# Altium project S7CAS-PLEIADES-CARTE-MERE-P_07.PrjPcb (part 1 of 2)
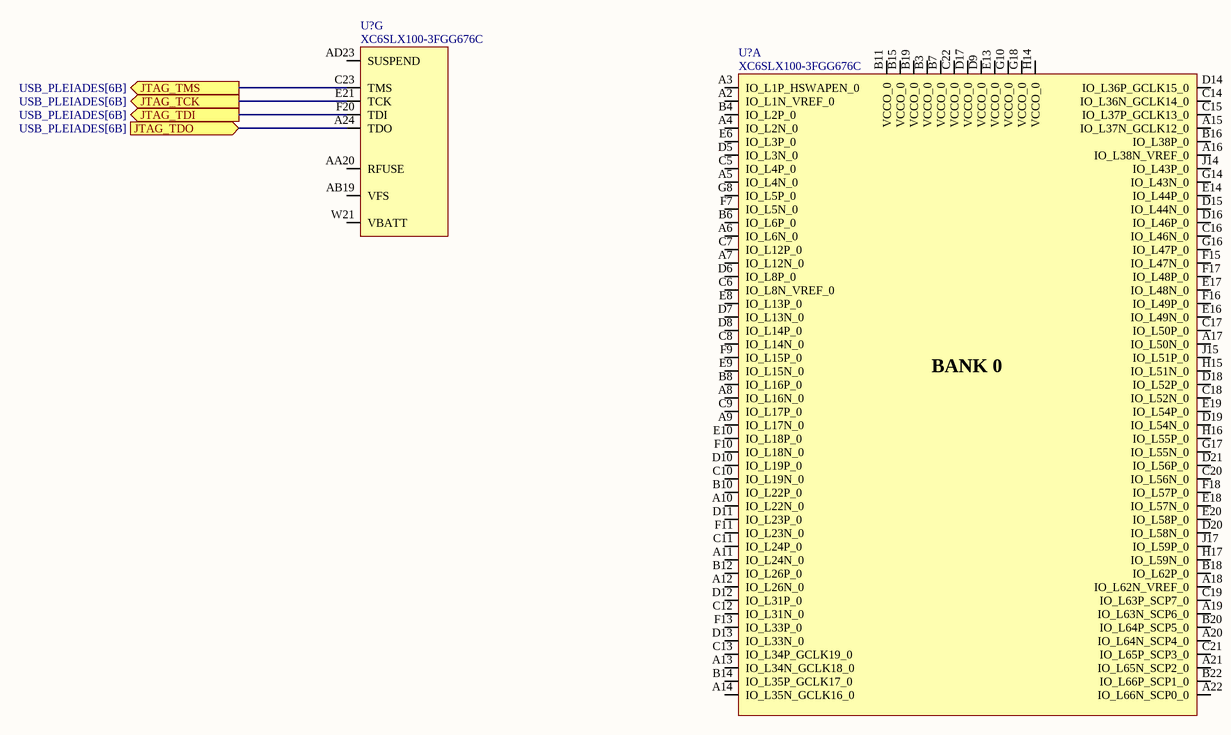
[diagram p0: FPGA_PLEIADES.SchDoc]
9 sheets, 185 parts. Net scope: flat (ports and power ports of the same name join across sheets).
Sheets:
  FPGA_PLEIADES.SchDoc
  FPGA_2_PLEIADES.SchDoc
  USB_PLEIADES.SchDoc
  CLOCK_PLEIADES.SchDoc
  FLASH_PLEIADES.SchDoc
  ETHERNET_PLEIADES.SchDoc
  DDR3_PLEIADES.SchDoc
  ADC_1_PLEIADES.SchDoc
  ADC_2_PLEIADES.SchDoc

## Sheet FPGA_PLEIADES.SchDoc
size Tabloid; SheetNumber: 1; SheetTotal: 8; Sheet_Name: Insert name in Document Parameters; Size: 11x17

### Parts
(Parts that share a designator on the sheet are numbered #1, #2 ... from top to bottom, then left to right.)
U?#1  XC6SLX100-3FGG676C  [FPGA_XILINX_FGG676]  (part G of 10)
U?#2  XC6SLX100-3FGG676C  [FPGA_XILINX_FGG676]  (part A of 10)

### Ports
JTAG_TCK (out, see USB_PLEIADES[6B]), JTAG_TDI (out, see USB_PLEIADES[6B]), JTAG_TDO (in, see USB_PLEIADES[6B]), JTAG_TMS (out, see USB_PLEIADES[6B])

### Nets
NetM??#1_10: U?#1.E21(TCK) ; port JTAG_TCK
NetM??#1_11: U?#1.A24(TDO) ; port JTAG_TDO
NetM??#1_12: U?#1.F20(TDI) ; port JTAG_TDI
NetM??#1_13: U?#1.C23(TMS) ; port JTAG_TMS

Not connected (* = marked no-connect by the designer): U?#1 AA20(RFUSE) AB19(VFS) AD23(SUSPEND) W21(VBATT); U?#2 A2(IO_L1N_VREF_0) A3(IO_L1P_HSWAPEN_0) A4(IO_L2N_0) A5(IO_L4N_0) A6(IO_L6N_0) A7(IO_L12N_0) A8(IO_L16N_0) A9(IO_L17N_0) A10(IO_L22N_0) A11(IO_L24N_0) A12(IO_L26N_0) A13(IO_L34N_GCLK18_0) A14(IO_L35N_GCLK16_0) A15(IO_L37N_GCLK12_0) A16(IO_L38N_VREF_0) A17(IO_L50N_0) A18(IO_L62N_VREF_0) A19(IO_L63N_SCP6_0) A20(IO_L64N_SCP4_0) A21(IO_L65N_SCP2_0) A22(IO_L66N_SCP0_0) B3(VCCO_0) B4(IO_L2P_0) B6(IO_L6P_0) B7(VCCO_0) B8(IO_L16P_0) B10(IO_L22P_0) B11(VCCO_0) B12(IO_L26P_0) B14(IO_L35P_GCLK17_0) B15(VCCO_0) B16(IO_L38P_0) B18(IO_L62P_0) B19(VCCO_0) B20(IO_L64P_SCP5_0) B22(IO_L66P_SCP1_0) C5(IO_L4P_0) C6(IO_L8N_VREF_0) C7(IO_L12P_0) C8(IO_L14N_0) C9(IO_L17P_0) C10(IO_L19N_0) C11(IO_L24P_0) C12(IO_L31N_0) C13(IO_L34P_GCLK19_0) C14(IO_L36N_GCLK14_0) C15(IO_L37P_GCLK13_0) C16(IO_L46N_0) C17(IO_L50P_0) C18(IO_L52N_0) C19(IO_L63P_SCP7_0) C20(IO_L56N_0) C21(IO_L65P_SCP3_0) C22(VCCO_0) D5(IO_L3N_0) D6(IO_L8P_0) D7(IO_L13N_0) D8(IO_L14P_0) D9(VCCO_0) D10(IO_L19P_0) D11(IO_L23P_0) D12(IO_L31P_0) D13(IO_L33N_0) D14(IO_L36P_GCLK15_0) D15(IO_L44N_0) D16(IO_L46P_0) D17(VCCO_0) D18(IO_L52P_0) D19(IO_L54N_0) D20(IO_L58N_0) D21(IO_L56P_0) E6(IO_L3P_0) E8(IO_L13P_0) E9(IO_L15N_0) E10(IO_L18P_0) E13(VCCO_0) E14(IO_L44P_0) E16(IO_L49N_0) E17(IO_L48N_0) E18(IO_L57N_0) E19(IO_L54P_0) E20(IO_L58P_0) F7(IO_L5N_0) F9(IO_L15P_0) F10(IO_L18N_0) F11(IO_L23N_0) F13(IO_L33P_0) F15(IO_L47N_0) F16(IO_L49P_0) F17(IO_L48P_0) F18(IO_L57P_0) G8(IO_L5P_0) G10(VCCO_0) G14(IO_L43N_0) G16(IO_L47P_0) G17(IO_L55N_0) G18(VCCO_0) H14(VCCO_0) H15(IO_L51N_0) H16(IO_L55P_0) H17(IO_L59N_0) J14(IO_L43P_0) J15(IO_L51P_0) J17(IO_L59P_0)

### Notes on the sheet
- Sheet Name
- Project Title
- Global Project
- Size
- Group
- Revision
- Date
- Sheet
- of
- Filename
- Designers
- (in symbol FPGA_XC6SLX100-3FGG676C, part A) BANK 0

### Library data of the parts
U?#1 U?#2 = FPGA_XC6SLX100-3FGG676C: FPGA - XILINX SPARTAN 6 480 I/O - BGA-676; Voltage: 1.14 V ~ 1.26 V; Current: *; Power: *; Mfg: Xilinx; Mfg Part Number: XC6SLX100-3FGG676C; HelpURL: https://www.xilinx.com/support/documentation/data_sheets/ds162.pdf; CreatedBy: Jonathan Bouchard; Temperature: 0°C ~ 85°C (TJ); Value: *; Precision: *; Package: BGA-676; Supplier 1: Digikey; Supplier Part Number 1: 122-1760-ND

## Sheet FPGA_2_PLEIADES.SchDoc
size Tabloid; SheetNumber: 2; SheetTotal: 8; Sheet_Name: Insert name in Document Parameters; Size: 11x17
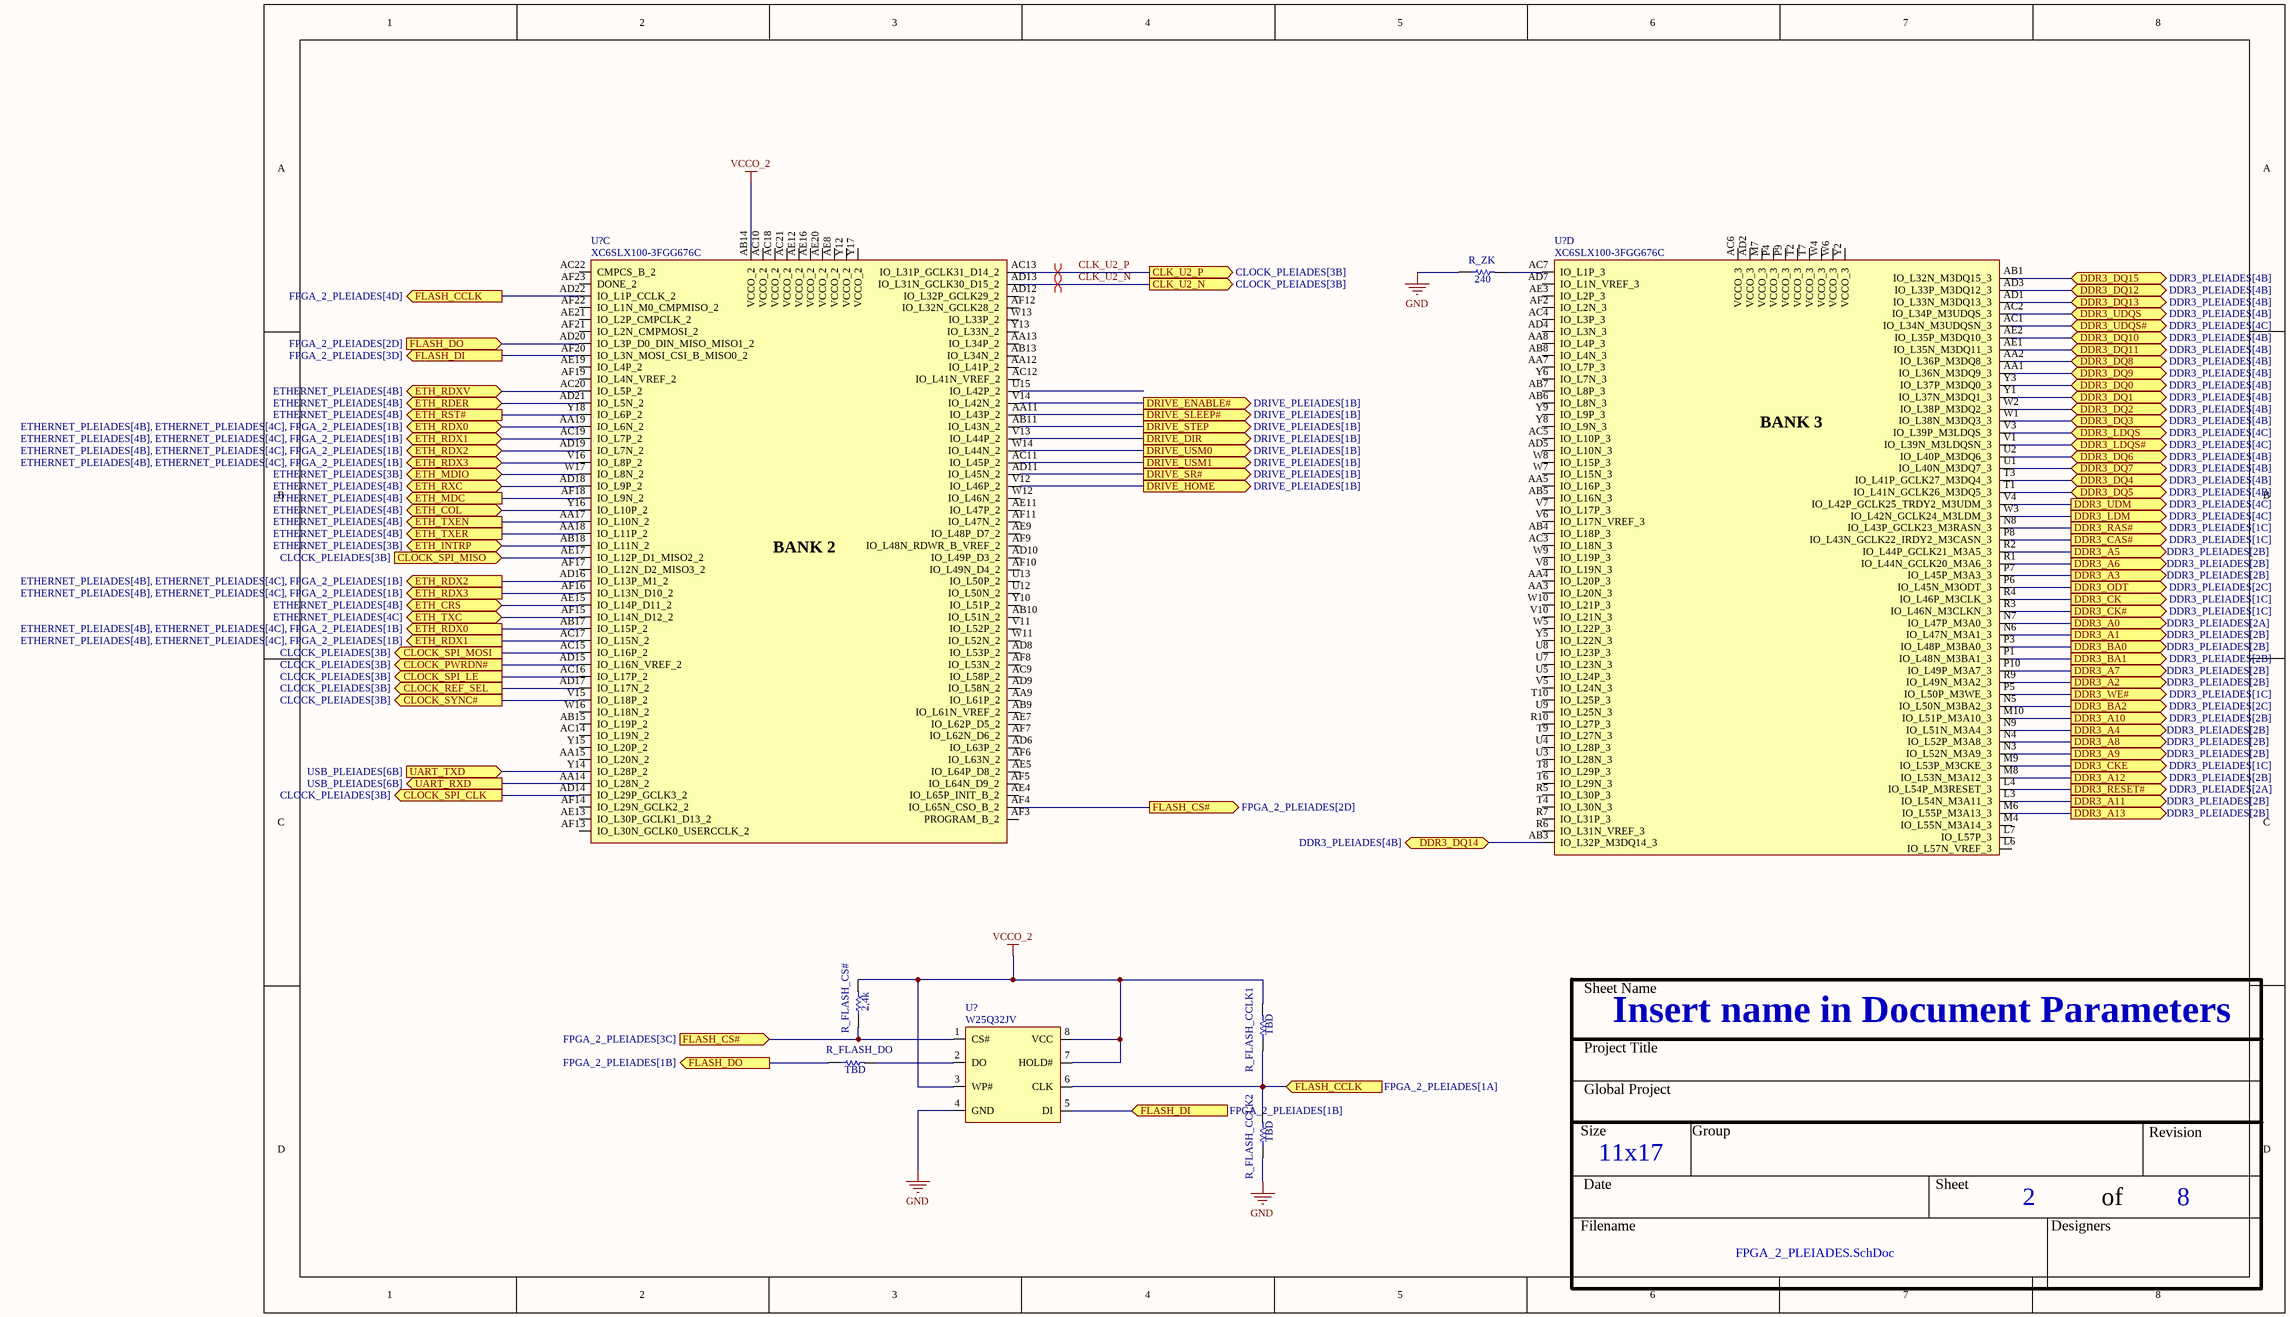
[diagram p1: FPGA_2_PLEIADES.SchDoc]

### Parts
(Parts that share a designator on the sheet are numbered #1, #2 ... from top to bottom, then left to right.)
R_FLASH_CCLK1  value TBD  [RES_0402]  (hidden comment: RES - 0402)
R_FLASH_CCLK2  value TBD  [RES_0402]  (hidden comment: RES - 0402)
R_FLASH_CS#  value 2,4k  [RES_0402]  (hidden comment: RES - 0402)
R_FLASH_DO  value TBD  [RES_0402]  (hidden comment: RES - 0402)
R_ZK  value 240  [RES_0402]  (hidden comment: RES - 0402)
U?#3  XC6SLX100-3FGG676C  [FPGA_XILINX_FGG676]  (part C of 10)
U?#4  XC6SLX100-3FGG676C  [FPGA_XILINX_FGG676]  (part D of 10)
U?#5  W25Q32JV  [SOIC127P790X216-8N]

### Ports
CLK_U2_N (out, see CLOCK_PLEIADES[3B]), CLK_U2_P (out, see CLOCK_PLEIADES[3B]), CLOCK_PWRDN# (out, see CLOCK_PLEIADES[3B]), CLOCK_REF_SEL (out, see CLOCK_PLEIADES[3B]), CLOCK_SPI_CLK (out, see CLOCK_PLEIADES[3B]), CLOCK_SPI_LE (out, see CLOCK_PLEIADES[3B]), CLOCK_SPI_MISO (in, see CLOCK_PLEIADES[3B]), CLOCK_SPI_MOSI (out, see CLOCK_PLEIADES[3B]), CLOCK_SYNC# (out, see CLOCK_PLEIADES[3B]), DDR3_A0 (out, see DDR3_PLEIADES[2A]), DDR3_A1 (out, see DDR3_PLEIADES[2B]), DDR3_A2 (out, see DDR3_PLEIADES[2B]), DDR3_A3 (out, see DDR3_PLEIADES[2B]), DDR3_A4 (out, see DDR3_PLEIADES[2B]), DDR3_A5 (out, see DDR3_PLEIADES[2B]), DDR3_A6 (out, see DDR3_PLEIADES[2B]), DDR3_A7 (out, see DDR3_PLEIADES[2B]), DDR3_A8 (out, see DDR3_PLEIADES[2B]), DDR3_A9 (out, see DDR3_PLEIADES[2B]), DDR3_A10 (out, see DDR3_PLEIADES[2B]), DDR3_A11 (out, see DDR3_PLEIADES[2B]), DDR3_A12 (out, see DDR3_PLEIADES[2B]), DDR3_A13 (out, see DDR3_PLEIADES[2B]), DDR3_BA0 (out, see DDR3_PLEIADES[2B]), DDR3_BA1 (out, see DDR3_PLEIADES[2B]), DDR3_BA2 (out, see DDR3_PLEIADES[2C]), DDR3_CAS# (out, see DDR3_PLEIADES[1C]), DDR3_CK (out, see DDR3_PLEIADES[1C]), DDR3_CK# (out, see DDR3_PLEIADES[1C]), DDR3_CKE (out, see DDR3_PLEIADES[1C]), DDR3_DQ0 (bidir, see DDR3_PLEIADES[4B]), DDR3_DQ1 (bidir, see DDR3_PLEIADES[4B]), DDR3_DQ2 (bidir, see DDR3_PLEIADES[4B]), DDR3_DQ3 (bidir, see DDR3_PLEIADES[4B]), DDR3_DQ4 (bidir, see DDR3_PLEIADES[4B]), DDR3_DQ5 (bidir, see DDR3_PLEIADES[4B]), DDR3_DQ6 (bidir, see DDR3_PLEIADES[4B]), DDR3_DQ7 (bidir, see DDR3_PLEIADES[4B]), DDR3_DQ8 (bidir, see DDR3_PLEIADES[4B]), DDR3_DQ9 (bidir, see DDR3_PLEIADES[4B]), DDR3_DQ10 (bidir, see DDR3_PLEIADES[4B]), DDR3_DQ11 (bidir, see DDR3_PLEIADES[4B]), DDR3_DQ12 (bidir, see DDR3_PLEIADES[4B]), DDR3_DQ13 (bidir, see DDR3_PLEIADES[4B]), DDR3_DQ14 (bidir, see DDR3_PLEIADES[4B]), DDR3_DQ15 (bidir, see DDR3_PLEIADES[4B]), DDR3_LDM (out, see DDR3_PLEIADES[4C]), DDR3_LDQS (bidir, see DDR3_PLEIADES[4C]), DDR3_LDQS# (bidir, see DDR3_PLEIADES[4C]), DDR3_ODT (out, see DDR3_PLEIADES[2C]), DDR3_RAS# (out, see DDR3_PLEIADES[1C]), DDR3_RESET# (out, see DDR3_PLEIADES[2A]), DDR3_UDM (out, see DDR3_PLEIADES[4C]), DDR3_UDQS (bidir, see DDR3_PLEIADES[4B]), DDR3_UDQS# (bidir, see DDR3_PLEIADES[4C]), DDR3_WE# (out, see DDR3_PLEIADES[1C]), DRIVE_DIR (out, see DRIVE_PLEIADES[1B]), DRIVE_ENABLE# (out, see DRIVE_PLEIADES[1B]), DRIVE_HOME (out, see DRIVE_PLEIADES[1B]), DRIVE_SLEEP# (out, see DRIVE_PLEIADES[1B]), DRIVE_SR# (out, see DRIVE_PLEIADES[1B]), DRIVE_STEP (out, see DRIVE_PLEIADES[1B]), DRIVE_USM0 (out, see DRIVE_PLEIADES[1B]), DRIVE_USM1 (out, see DRIVE_PLEIADES[1B]), ETH_COL (bidir, see ETHERNET_PLEIADES[4B]), ETH_CRS (bidir, see ETHERNET_PLEIADES[4B]), ETH_INTRP (bidir, see ETHERNET_PLEIADES[3B]), ETH_MDC (out, see ETHERNET_PLEIADES[4B]), ETH_MDIO (bidir, see ETHERNET_PLEIADES[3B]), ETH_RDER (bidir, see ETHERNET_PLEIADES[4B]), ETH_RDX0 (bidir, see ETHERNET_PLEIADES[4B], ETHERNET_PLEIADES[4C], FPGA_2_PLEIADES[1B]), ETH_RDX0 (out, see ETHERNET_PLEIADES[4B], ETHERNET_PLEIADES[4C], FPGA_2_PLEIADES[1B]), ETH_RDX1 (bidir, see ETHERNET_PLEIADES[4B], ETHERNET_PLEIADES[4C], FPGA_2_PLEIADES[1B]), ETH_RDX1 (out, see ETHERNET_PLEIADES[4B], ETHERNET_PLEIADES[4C], FPGA_2_PLEIADES[1B]), ETH_RDX2 (bidir, see ETHERNET_PLEIADES[4B], ETHERNET_PLEIADES[4C], FPGA_2_PLEIADES[1B]), ETH_RDX2 (out, see ETHERNET_PLEIADES[4B], ETHERNET_PLEIADES[4C], FPGA_2_PLEIADES[1B]), ETH_RDX3 (bidir, see ETHERNET_PLEIADES[4B], ETHERNET_PLEIADES[4C], FPGA_2_PLEIADES[1B]), ETH_RDX3 (out, see ETHERNET_PLEIADES[4B], ETHERNET_PLEIADES[4C], FPGA_2_PLEIADES[1B]), ETH_RDXV (bidir, see ETHERNET_PLEIADES[4B]), ETH_RST# (out, see ETHERNET_PLEIADES[4B]), ETH_RXC (bidir, see ETHERNET_PLEIADES[4B]), ETH_TXC (bidir, see ETHERNET_PLEIADES[4C]), ETH_TXEN (out, see ETHERNET_PLEIADES[4B]), ETH_TXER (out, see ETHERNET_PLEIADES[4B]), FLASH_CCLK (in, see FPGA_2_PLEIADES[1A]), FLASH_CCLK (out, see FPGA_2_PLEIADES[4D]), FLASH_CS# (in, see FPGA_2_PLEIADES[3C]), FLASH_CS# (out, see FPGA_2_PLEIADES[2D]), FLASH_DI (in, see FPGA_2_PLEIADES[1B]), FLASH_DI (out, see FPGA_2_PLEIADES[3D]), FLASH_DO (in, see FPGA_2_PLEIADES[2D]), FLASH_DO (out, see FPGA_2_PLEIADES[1B]), UART_RXD (out, see USB_PLEIADES[6B]), UART_TXD (in, see USB_PLEIADES[6B])

### Nets
GND: R_FLASH_CCLK2.1 R_ZK.1 U?#5.4(GND)  [project net +0V75]
VCCO_2: R_FLASH_CCLK1.2 R_FLASH_CS#.2 U?#3.AB14(VCCO_2) U?#5.3(WP#) U?#5.7(HOLD#) U?#5.8(VCC)
CLK_U2_N: U?#3.AD13(IO_L31N_GCLK30_D15_2) ; port CLK_U2_N
CLK_U2_P: U?#3.AC13(IO_L31P_GCLK31_D14_2) ; port CLK_U2_P
DDR3_CK_N: U?#4.R3(IO_L46N_M3CLKN_3) ; port DDR3_CK#
DDR3_CK_P: U?#4.R4(IO_L46P_M3CLK_3) ; port DDR3_CK
DDR3_LDQS_N: U?#4.V1(IO_L39N_M3LDQSN_3) ; port DDR3_LDQS#
DDR3_LDQS_P: U?#4.V3(IO_L39P_M3LDQS_3) ; port DDR3_LDQS
DDR3_UDQS_N: U?#4.AC1(IO_L34N_M3UDQSN_3) ; port DDR3_UDQS#
DDR3_UDQS_P: U?#4.AC2(IO_L34P_M3UDQS_3) ; port DDR3_UDQS
NetD_RST#2_2: U?#3.Y18(IO_L6P_2) ; port ETH_RST#
NetM??#1_5: U?#3.AA14(IO_L28N_2) ; port UART_RXD
NetM??#1_6: U?#3.Y14(IO_L28P_2) ; port UART_TXD
NetR_A?#1_1: U?#4.M6(IO_L55P_M3A13_3) ; port DDR3_A13
NetR_A?#2_1: U?#4.L3(IO_L54N_M3A11_3) ; port DDR3_A11
NetR_A?#3_1: U?#4.N3(IO_L52N_M3A9_3) ; port DDR3_A9
NetR_A?#4_1: U?#4.P10(IO_L49P_M3A7_3) ; port DDR3_A7
NetR_A?#5_1: U?#4.R2(IO_L44P_GCLK21_M3A5_3) ; port DDR3_A5
NetR_A?#6_1: U?#4.P7(IO_L45P_M3A3_3) ; port DDR3_A3
NetR_A?#7_1: U?#4.N6(IO_L47N_M3A1_3) ; port DDR3_A1
NetR_A?#8_1: U?#4.M8(IO_L53N_M3A12_3) ; port DDR3_A12
NetR_A?#9_1: U?#4.M10(IO_L51P_M3A10_3) ; port DDR3_A10
NetR_A?#10_1: U?#4.N4(IO_L52P_M3A8_3) ; port DDR3_A8
NetR_A?#11_1: U?#4.R1(IO_L44N_GCLK20_M3A6_3) ; port DDR3_A6
NetR_A?#12_1: U?#4.N9(IO_L51N_M3A4_3) ; port DDR3_A4
NetR_A?#13_1: U?#4.R9(IO_L49N_M3A2_3) ; port DDR3_A2
NetR_A?#14_1: U?#4.N7(IO_L47P_M3A0_3) ; port DDR3_A0
NetR_BA?#1_1: U?#4.N5(IO_L50N_M3BA2_3) ; port DDR3_BA2
NetR_BA?#2_1: U?#4.P1(IO_L48N_M3BA1_3) ; port DDR3_BA1
NetR_BA?#3_1: U?#4.P3(IO_L48P_M3BA0_3) ; port DDR3_BA0
NetR_CAS#?_1: U?#4.P8(IO_L43N_GCLK22_IRDY2_M3CASN_3) ; port DDR3_CAS#
NetR_CKE?_2: U?#4.M9(IO_L53P_M3CKE_3) ; port DDR3_CKE
NetR_FLASH_CCLK1_1: R_FLASH_CCLK1.1 R_FLASH_CCLK2.2 U?#3.AD22(IO_L1P_CCLK_2) U?#5.6(CLK) ; port FLASH_CCLK
NetR_FLASH_CS#_1: R_FLASH_CS#.1 U?#3.AF4(IO_L65N_CSO_B_2) U?#5.1(CS#) ; port FLASH_CS#
NetR_FLASH_DO_1: R_FLASH_DO.1 U?#3.AD20(IO_L3P_D0_DIN_MISO_MISO1_2) ; port FLASH_DO
NetR_FLASH_DO_2: R_FLASH_DO.2 U?#5.2(DO)
NetR_ODT?_2: U?#4.P6(IO_L45N_M3ODT_3) ; port DDR3_ODT
NetR_RAS#?_1: U?#4.N8(IO_L43P_GCLK23_M3RASN_3) ; port DDR3_RAS#
NetR_RESET?_1: U?#4.L4(IO_L54P_M3RESET_3) ; port DDR3_RESET#
NetR_TDCT?#1_1: U?#3.AB18(IO_L11N_2) ; port ETH_INTRP
NetR_TDCT?#2_1: U?#3.W17(IO_L8N_2) ; port ETH_MDIO
NetR_WE#?_1: U?#4.P5(IO_L50P_M3WE_3) ; port DDR3_WE#
NetR_ZK_2: R_ZK.2 U?#4.AC7(IO_L1P_3)
NetU?#3_AA11: U?#3.AA11(IO_L43P_2) ; port DRIVE_SLEEP#
NetU?#3_AA17: U?#3.AA17(IO_L10N_2) ; port ETH_TXEN
NetU?#3_AA18: U?#3.AA18(IO_L11P_2) ; port ETH_TXER
NetU?#3_AA19: U?#3.AA19(IO_L6N_2) U?#3.AB17(IO_L15P_2) ; port ETH_RDX0
NetU?#3_AB11: U?#3.AB11(IO_L43N_2) ; port DRIVE_STEP
NetU?#3_AC11: U?#3.AC11(IO_L45P_2) ; port DRIVE_USM1
NetU?#3_AC15: U?#3.AC15(IO_L16P_2) ; port CLOCK_SPI_MOSI
NetU?#3_AC16: U?#3.AC16(IO_L17P_2) ; port CLOCK_SPI_LE
NetU?#3_AC17: U?#3.AC17(IO_L15N_2) U?#3.AC19(IO_L7P_2) ; port ETH_RDX1
NetU?#3_AC20: U?#3.AC20(IO_L5P_2) ; port ETH_RDXV
NetU?#3_AD11: U?#3.AD11(IO_L45N_2) ; port DRIVE_SR#
NetU?#3_AD14: U?#3.AD14(IO_L29P_GCLK3_2) ; port CLOCK_SPI_CLK
NetU?#3_AD15: U?#3.AD15(IO_L16N_VREF_2) ; port CLOCK_PWRDN#
NetU?#3_AD16: U?#3.AD16(IO_L13P_M1_2) U?#3.AD19(IO_L7N_2) ; port ETH_RDX2
NetU?#3_AD17: U?#3.AD17(IO_L17N_2) ; port CLOCK_REF_SEL
NetU?#3_AD18: U?#3.AD18(IO_L9P_2) ; port ETH_RXC
NetU?#3_AD21: U?#3.AD21(IO_L5N_2) ; port ETH_RDER
NetU?#3_AE15: U?#3.AE15(IO_L14P_D11_2) ; port ETH_CRS
NetU?#3_AE17: U?#3.AE17(IO_L12P_D1_MISO2_2) ; port CLOCK_SPI_MISO
NetU?#3_AF15: U?#3.AF15(IO_L14N_D12_2) ; port ETH_TXC
NetU?#3_AF16: U?#3.AF16(IO_L13N_D10_2) U?#3.V16(IO_L8P_2) ; port ETH_RDX3
NetU?#3_AF18: U?#3.AF18(IO_L9N_2) ; port ETH_MDC
NetU?#3_AF20: U?#3.AF20(IO_L3N_MOSI_CSI_B_MISO0_2) U?#5.5(DI) ; port FLASH_DI
NetU?#3_V12: U?#3.V12(IO_L46P_2) ; port DRIVE_HOME
NetU?#3_V13: U?#3.V13(IO_L44P_2) ; port DRIVE_DIR
NetU?#3_V14: U?#3.V14(IO_L42N_2) ; port DRIVE_ENABLE#
NetU?#3_V15: U?#3.V15(IO_L18P_2) ; port CLOCK_SYNC#
NetU?#3_W14: U?#3.W14(IO_L44N_2) ; port DRIVE_USM0
NetU?#3_Y16: U?#3.Y16(IO_L10P_2) ; port ETH_COL
NetU?#4_AA1: U?#4.AA1(IO_L36N_M3DQ9_3) ; port DDR3_DQ9
NetU?#4_AA2: U?#4.AA2(IO_L36P_M3DQ8_3) ; port DDR3_DQ8
NetU?#4_AB1: U?#4.AB1(IO_L32N_M3DQ15_3) ; port DDR3_DQ15
NetU?#4_AB3: U?#4.AB3(IO_L32P_M3DQ14_3) ; port DDR3_DQ14
NetU?#4_AD1: U?#4.AD1(IO_L33N_M3DQ13_3) ; port DDR3_DQ13
NetU?#4_AD3: U?#4.AD3(IO_L33P_M3DQ12_3) ; port DDR3_DQ12
NetU?#4_AE1: U?#4.AE1(IO_L35N_M3DQ11_3) ; port DDR3_DQ11
NetU?#4_AE2: U?#4.AE2(IO_L35P_M3DQ10_3) ; port DDR3_DQ10
NetU?#4_T1: U?#4.T1(IO_L41N_GCLK26_M3DQ5_3) ; port DDR3_DQ5
NetU?#4_T3: U?#4.T3(IO_L41P_GCLK27_M3DQ4_3) ; port DDR3_DQ4
NetU?#4_U1: U?#4.U1(IO_L40N_M3DQ7_3) ; port DDR3_DQ7
NetU?#4_U2: U?#4.U2(IO_L40P_M3DQ6_3) ; port DDR3_DQ6
NetU?#4_V4: U?#4.V4(IO_L42P_GCLK25_TRDY2_M3UDM_3) ; port DDR3_UDM
NetU?#4_W1: U?#4.W1(IO_L38N_M3DQ3_3) ; port DDR3_DQ3
NetU?#4_W2: U?#4.W2(IO_L38P_M3DQ2_3) ; port DDR3_DQ2
NetU?#4_W3: U?#4.W3(IO_L42N_GCLK24_M3LDM_3) ; port DDR3_LDM
NetU?#4_Y1: U?#4.Y1(IO_L37N_M3DQ1_3) ; port DDR3_DQ1
NetU?#4_Y3: U?#4.Y3(IO_L37P_M3DQ0_3) ; port DDR3_DQ0

Not connected (* = marked no-connect by the designer): U?#3 AA9(IO_L61P_2) AA12(IO_L41P_2) AA13(IO_L34P_2) AA15(IO_L20N_2) AB9(IO_L61N_VREF_2) AB10(IO_L51N_2) AB13(IO_L34N_2) AB15(IO_L19P_2) AC9(IO_L58P_2) AC10(VCCO_2) AC12(IO_L41N_VREF_2) AC14(IO_L19N_2) AC18(VCCO_2) AC21(VCCO_2) AC22(CMPCS_B_2) AD6(IO_L63P_2) AD8(IO_L53P_2) AD9(IO_L58N_2) AD10(IO_L49P_D3_2) AD12(IO_L32P_GCLK29_2) AE4(IO_L65P_INIT_B_2) AE5(IO_L64P_D8_2) AE7(IO_L62P_D5_2) AE8(VCCO_2) AE9(IO_L48P_D7_2) AE11(IO_L47P_2) AE12(VCCO_2) AE13(IO_L30P_GCLK1_D13_2) AE16(VCCO_2) AE19(IO_L4P_2) AE20(VCCO_2) AE21(IO_L2P_CMPCLK_2) AF3(PROGRAM_B_2) AF5(IO_L64N_D9_2) AF6(IO_L63N_2) AF7(IO_L62N_D6_2) AF8(IO_L53N_2) AF9(IO_L48N_RDWR_B_VREF_2) AF10(IO_L49N_D4_2) AF11(IO_L47N_2) AF12(IO_L32N_GCLK28_2) AF13(IO_L30N_GCLK0_USERCCLK_2) AF14(IO_L29N_GCLK2_2) AF17(IO_L12N_D2_MISO3_2) AF19(IO_L4N_VREF_2) AF21(IO_L2N_CMPMOSI_2) AF22(IO_L1N_M0_CMPMISO_2) AF23(DONE_2) U12(IO_L50N_2) U13(IO_L50P_2) U15(IO_L42P_2) V11(IO_L52P_2) W11(IO_L52N_2) W12(IO_L46N_2) W13(IO_L33P_2) W16(IO_L18N_2) Y10(IO_L51P_2) Y12(VCCO_2) Y13(IO_L33N_2) Y15(IO_L20P_2) Y17(VCCO_2); U?#4 AA3(IO_L20N_3) AA4(IO_L20P_3) AA5(IO_L16P_3) AA7(IO_L7P_3) AA8(IO_L4P_3) AB4(IO_L18P_3) AB5(IO_L16N_3) AB6(IO_L8N_3) AB7(IO_L8P_3) AB8(IO_L4N_3) AC3(IO_L18N_3) AC4(IO_L3P_3) AC5(IO_L10P_3) AC6(VCCO_3) AD2(VCCO_3) AD4(IO_L3N_3) AD5(IO_L10N_3) AD7(IO_L1N_VREF_3) AE3(IO_L2P_3) AF2(IO_L2N_3) L6(IO_L57N_VREF_3) L7(IO_L57P_3) M4(IO_L55N_M3A14_3) M7(VCCO_3) P4(VCCO_3) P9(VCCO_3) R5(IO_L30P_3) R6(IO_L31N_VREF_3) R7(IO_L31P_3) R10(IO_L27P_3) T2(VCCO_3) T4(IO_L30N_3) T6(IO_L29N_3) T7(VCCO_3) T8(IO_L29P_3) T9(IO_L27N_3) T10(IO_L25P_3) U3(IO_L28N_3) U4(IO_L28P_3) U5(IO_L24P_3) U7(IO_L23N_3) U8(IO_L23P_3) U9(IO_L25N_3) V5(IO_L24N_3) V6(IO_L17N_VREF_3) V7(IO_L17P_3) V8(IO_L19N_3) V10(IO_L21N_3) W4(VCCO_3) W5(IO_L22P_3) W6(VCCO_3) W7(IO_L15N_3) W8(IO_L15P_3) W9(IO_L19P_3) W10(IO_L21P_3) Y2(VCCO_3) Y5(IO_L22N_3) Y6(IO_L7N_3) Y8(IO_L9N_3) Y9(IO_L9P_3)

### Layout directives
differential pair: CLK_U2_N, CLK_U2_P

### Notes on the sheet
- Sheet Name
- Project Title
- Global Project
- Size
- Group
- Revision
- Date
- Sheet
- of
- Filename
- Designers
- (in symbol FPGA_XC6SLX100-3FGG676C, part C) BANK 2
- (in symbol FPGA_XC6SLX100-3FGG676C, part D) BANK 3

### Library data of the parts
R_FLASH_CCLK1 R_FLASH_CCLK2 R_FLASH_CS# R_FLASH_DO R_ZK = RES - 0402: Voltage: 50V; Power: 1/16W; Precision: 1%; Current: *; CreatedBy: Jonathan Bouchard; Package: 0402
U?#3 U?#4 = FPGA_XC6SLX100-3FGG676C: as U?#1 on sheet FPGA_PLEIADES; Current: *; Power: *; Mfg: Xilinx; Mfg Part Number: XC6SLX100-3FGG676C; HelpURL: https://www.xilinx.com/support/documentation/data_sheets/ds162.pdf; CreatedBy: Jonathan Bouchard; Temperature: 0°C ~ 85°C (TJ); Value: *; Precision: *; Package: BGA-676; Supplier 1: Digikey; Supplier Part Number 1: 122-1760-ND
U?#5 = CMP-00001-1: 3V 32M-BIT SERIAL FLASH MEMORY WITH DUAL, QUAD SPI

## Sheet USB_PLEIADES.SchDoc
size Tabloid; Sheet_Name: Insert name in Document Parameters; Size: 11x17
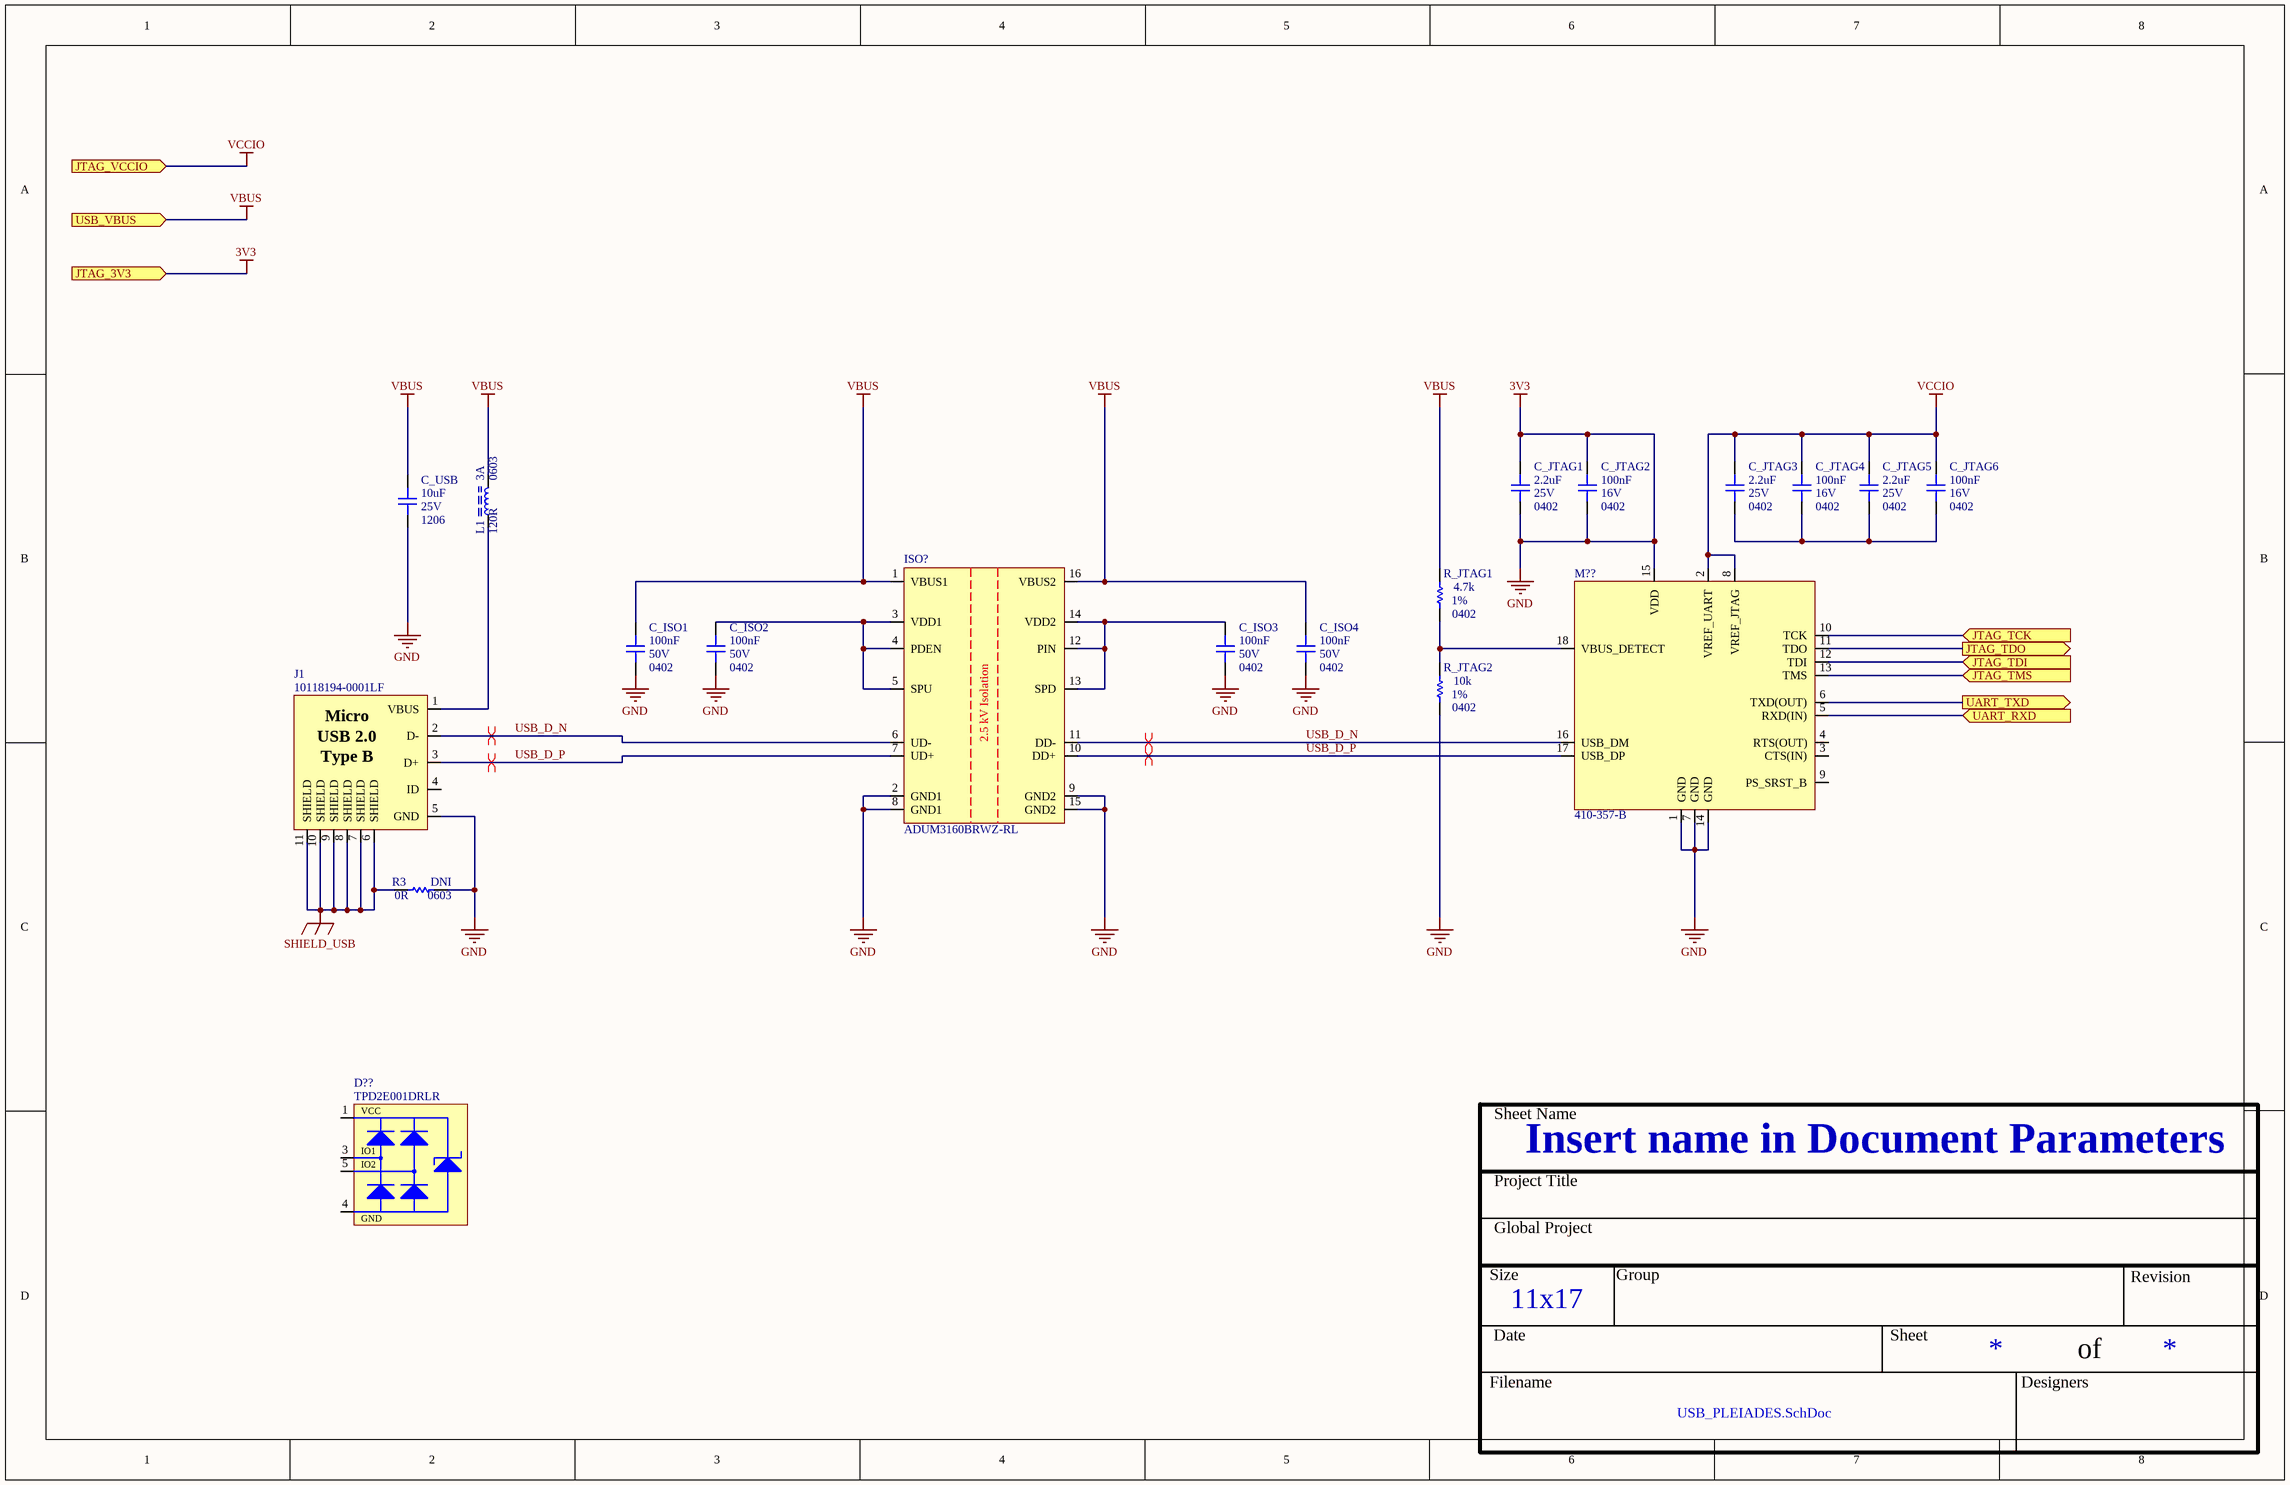
[diagram p2: USB_PLEIADES.SchDoc]

### Parts
(Parts that share a designator on the sheet are numbered #1, #2 ... from top to bottom, then left to right.)
C_ISO1  value 100nF  Voltage: 50V  Package: 0402  [CAP_0402]  (hidden comment: CAP - 0402)
C_ISO2  value 100nF  Voltage: 50V  Package: 0402  [CAP_0402]  (hidden comment: CAP - 0402)
C_ISO3  value 100nF  Voltage: 50V  Package: 0402  [CAP_0402]  (hidden comment: CAP - 0402)
C_ISO4  value 100nF  Voltage: 50V  Package: 0402  [CAP_0402]  (hidden comment: CAP - 0402)
C_JTAG1  value 2.2uF  Voltage: 25V  Package: 0402  [CAP_0402]  (hidden comment: CAP - 0402)
C_JTAG2  value 100nF  Voltage: 16V  Package: 0402  [CAP_0402]  (hidden comment: CAP - 0402)
C_JTAG3  value 2.2uF  Voltage: 25V  Package: 0402  [CAP_0402]  (hidden comment: CAP - 0402)
C_JTAG4  value 100nF  Voltage: 16V  Package: 0402  [CAP_0402]  (hidden comment: CAP - 0402)
C_JTAG5  value 2.2uF  Voltage: 25V  Package: 0402  [CAP_0402]  (hidden comment: CAP - 0402)
C_JTAG6  value 100nF  Voltage: 16V  Package: 0402  [CAP_0402]  (hidden comment: CAP - 0402)
C_USB  value 10uF  Voltage: 25V  Package: 1206  [CAP_1206]  (hidden comment: CAP - 1206)
D??  TPD2E001DRLR  [TVS_USB_TPD2E001DRLR]
ISO?  ADUM3160BRWZ-RL  [ISO_ADUM3160BRWZ-RL]
J1  10118194-0001LF  [CON_USB_10118194-0001LF]
L1  value 120R  Current: 3A  Package: 0603  [FER_0603]  (hidden comment: FER - 0603)
M??#1  410-357-B  [MOD_JTAG_410-357-B]
R3  value 0R  Package: 0603  Precision: DNI  [RES_0603]  (hidden comment: RES - 0603)
R_JTAG1  value 4.7k  Package: 0402  Precision: 1%  [RES_0402]  (hidden comment: RES - 0402)
R_JTAG2  value 10k  Package: 0402  Precision: 1%  [RES_0402]  (hidden comment: RES - 0402)

### Ports
JTAG_3V3 (in), JTAG_TCK (in), JTAG_TDI (in), JTAG_TDO (out), JTAG_TMS (in), JTAG_VCCIO (in), UART_RXD (in), UART_TXD (out), USB_VBUS (in)

### Nets
3V3: C_ISO1.1 C_ISO2.1 C_ISO3.1 C_ISO4.1 C_JTAG1.1 C_JTAG1.2 C_JTAG2.1 C_JTAG2.2 C_USB.1 ISO?.2(GND1) ISO?.8(GND1) ISO?.9(GND2) ISO?.15(GND2) J1.5(GND) M??#1.1(GND) M??#1.7(GND) M??#1.14(GND) M??#1.15(VDD) R3.1 R_JTAG2.1 ; port JTAG_3V3  [also labelled GND]  [project net +0V75]
SHIELD_USB: J1.6(SHIELD) J1.7(SHIELD) J1.8(SHIELD) J1.9(SHIELD) J1.10(SHIELD) J1.11(SHIELD) R3.2
VBUS: C_ISO1.2 C_ISO4.2 C_USB.2 ISO?.1(VBUS1) ISO?.16(VBUS2) L1.1 R_JTAG1.2 ; port USB_VBUS
VCCIO: C_JTAG3.2 C_JTAG4.2 C_JTAG5.2 C_JTAG6.2 M??#1.2(VREF_UART) M??#1.8(VREF_JTAG) ; port JTAG_VCCIO
USB_D_N: ISO?.6(UD-) ISO?.11(DD-) J1.2(D-) M??#1.16(USB_DM)
USB_D_P: ISO?.7(UD+) ISO?.10(DD+) J1.3(D+) M??#1.17(USB_DP)
NetC_ISO2_2: C_ISO2.2 ISO?.3(VDD1) ISO?.4(PDEN) ISO?.5(SPU)
NetC_ISO3_2: C_ISO3.2 ISO?.12(PIN) ISO?.13(SPD) ISO?.14(VDD2)
NetC_JTAG3_1: C_JTAG3.1 C_JTAG4.1 C_JTAG5.1 C_JTAG6.1
NetJ1_1: J1.1(VBUS) L1.2
NetM??#1_5: M??#1.5(RXD(IN)) ; port UART_RXD
NetM??#1_6: M??#1.6(TXD(OUT)) ; port UART_TXD
NetM??#1_10: M??#1.10(TCK) ; port JTAG_TCK
NetM??#1_11: M??#1.11(TDO) ; port JTAG_TDO
NetM??#1_12: M??#1.12(TDI) ; port JTAG_TDI
NetM??#1_13: M??#1.13(TMS) ; port JTAG_TMS
NetM??#1_18: M??#1.18(VBUS_DETECT) R_JTAG1.1 R_JTAG2.2

Not connected (* = marked no-connect by the designer): D?? 1(VCC) 2(NC) 3(IO1) 4(GND) 5(IO2); J1 4(ID); M??#1 3(CTS(IN)) 4(RTS(OUT)) 9(PS_SRST_B)

### Layout directives
differential pair: USB_D_N, USB_D_P

### Notes on the sheet
- Sheet Name
- Project Title
- Global Project
- Size
- Group
- Revision
- Date
- Sheet
- of
- Filename
- Designers
- (in symbol CON_USB_10118194-0001LF) Micro; USB 2.0; Type B
- (in symbol ISO_ADUM3160BRWZ-RL) 2.5 kV Isolation

### Library data of the parts
C_ISO1-C_ISO4 C_JTAG1-C_JTAG6 = CAP - 0402: Precision: 10%; Current: *; CreatedBy: Jonathan Bouchard; Power: *
C_USB = CAP - 1206: Precision: 10%; Current: *; CreatedBy: Jonathan Bouchard; Power: *
D?? = TVS_USB_TPD2E001DRLR: TVS - USB TVS DIODE 5.5V - SOT-553; Manufacturer #1: Texas Instruments; Value: 11V Breakdown; Voltage Rating: 5.5V (Max); GRAMS Lib Spec: 2.8; Magnetic Material: YES; Cryo: UNKNOWN; Tolerance: *; Current Rating: *; Power Max: *; HelpURL: http://www.ti.com/lit/ds/symlink/tpd2e001.pdf; CreatedBy/Date: Jonathan Bouchard 2018-07-10; VerifiedBy: Arnaud Samson 16-07-18; Temperature: -40°C ~ 85°C (TA); Package: SOT-553; Manufacturer #2: *; Note: *; Assembly Type: SMD; Part Number #2: *; Part Number #1: TPD2E001DRLR; Polarized: YES; Supplier 1: Digi-Key; Supplier Part Number 1: 296-21883-1-ND
ISO? = ISO_ADUM3160BRWZ-RL: ISO - DGTL ISO 2.5KV 2CH USB - 16SOIC; Manufacturer #1: Analog Devices; Value: 2500Vrms voltage isolation; Voltage Rating: 3~5.5V; GRAMS Lib Spec: 2.8; Magnetic Material: UNKNOWN; Polarized: Yes; Tolerance: *; Current Rating: *; Power Max: *; HelpURL: https://www.analog.com/media/en/technical-documentation/data-sheets/ADuM3160.pdf; CreatedBy/Date: Tommy Rossignol 2018-11-16; VerifiedBy: Caroline Paulin - 13 février 2019; Temperature: -40°C ~ 105°C; Package: 16-SOIC; Manufacturer #2: *; Assembly Type: SMD; Part Number #2: *; Part Number #1: ADUM3160BRWZ-RL; Supplier 1: Digi-Key; Supplier Part Number 1: ADUM3160BRWZ-RLCT-ND; Cryo: UNKNOWN
J1 = CON_USB_10118194-0001LF: CON - USB MICRO B RECPT SMT R/A - 4PIN; Manufacturer #1: Amphenol FCI; Value: USB - Micro B; Voltage Rating: 100VAC; Current Rating: 1.8A; GRAMS Lib Spec: 2.8; Magnetic Material: YES; Cryo: UNKNOWN; Tolerance: *; Power Max: *; HelpURL: https://cdn.amphenol-icc.com/media/wysiwyg/files/drawing/10118194.pdf; CreatedBy/Date: Arnaud Samson - 09/07/18; VerifiedBy: Jonathan Bouchard 2018-07-12; Temperature: -30°C ~ 80°C; Package: 5-SMD; Manufacturer #2: *; Note: *; Assembly Type: SMD; Part Number #2: *; Part Number #1: 10118194-0001LF; Polarized: YES; Supplier 1: Digi-Key; Supplier Part Number 1: 609-4618-1-ND
M??#1 = MOD_JTAG_410-357-B: MOD - JTAG-SMT3-NC Programming Module For Xilinx FPGA - 18-SMT; Manufacturer #1: Digilent; Voltage Rating: VDD: 2.97V~3.63V, VJTAG/VUART: 1.65V~5.5V; GRAMS Lib Spec: 2.8; Note: Prior to reflow, the JTAG-SMT3-NC module must be dried at 125°C for 17 hours; Magnetic Material: Unknown; Polarized: Yes; Value: *; Tolerance: *; Current Rating: *; Power Max: *; HelpURL: https://reference.digilentinc.com/_media/reference/programmers/jtag-smt3/jtag-smt3-nc_rm.pdf; CreatedBy/Date: Tommy Rossignol 2018-11-23; VerifiedBy: Nicolas V. (2019-01-28); Temperature: -40°C ~ 85°C; Package: 18-pad SMT; Manufacturer #2: *; Assembly Type: SMD; Part Number #2: *; Part Number #1: 410-357-B; Supplier 1: Digi-Key; Supplier Part Number 1: 1286-1196-ND; Cryo: UNKNOWN
R_JTAG1 R_JTAG2 = RES - 0402: Voltage: 50V; Power: 1/16W; Current: *; CreatedBy: Jonathan Bouchard
L1 = FER - 0603: Voltage: *; CreatedBy: Jonathan Bouchard; Power: *; Precision: *
R3 = RES - 0603: Current: *; CreatedBy: Jonathan Bouchard

## Sheet CLOCK_PLEIADES.SchDoc
size Tabloid; SheetNumber: 4; SheetTotal: 10; Sheet_Name: Insert name in Document Parameters; Size: 11x17
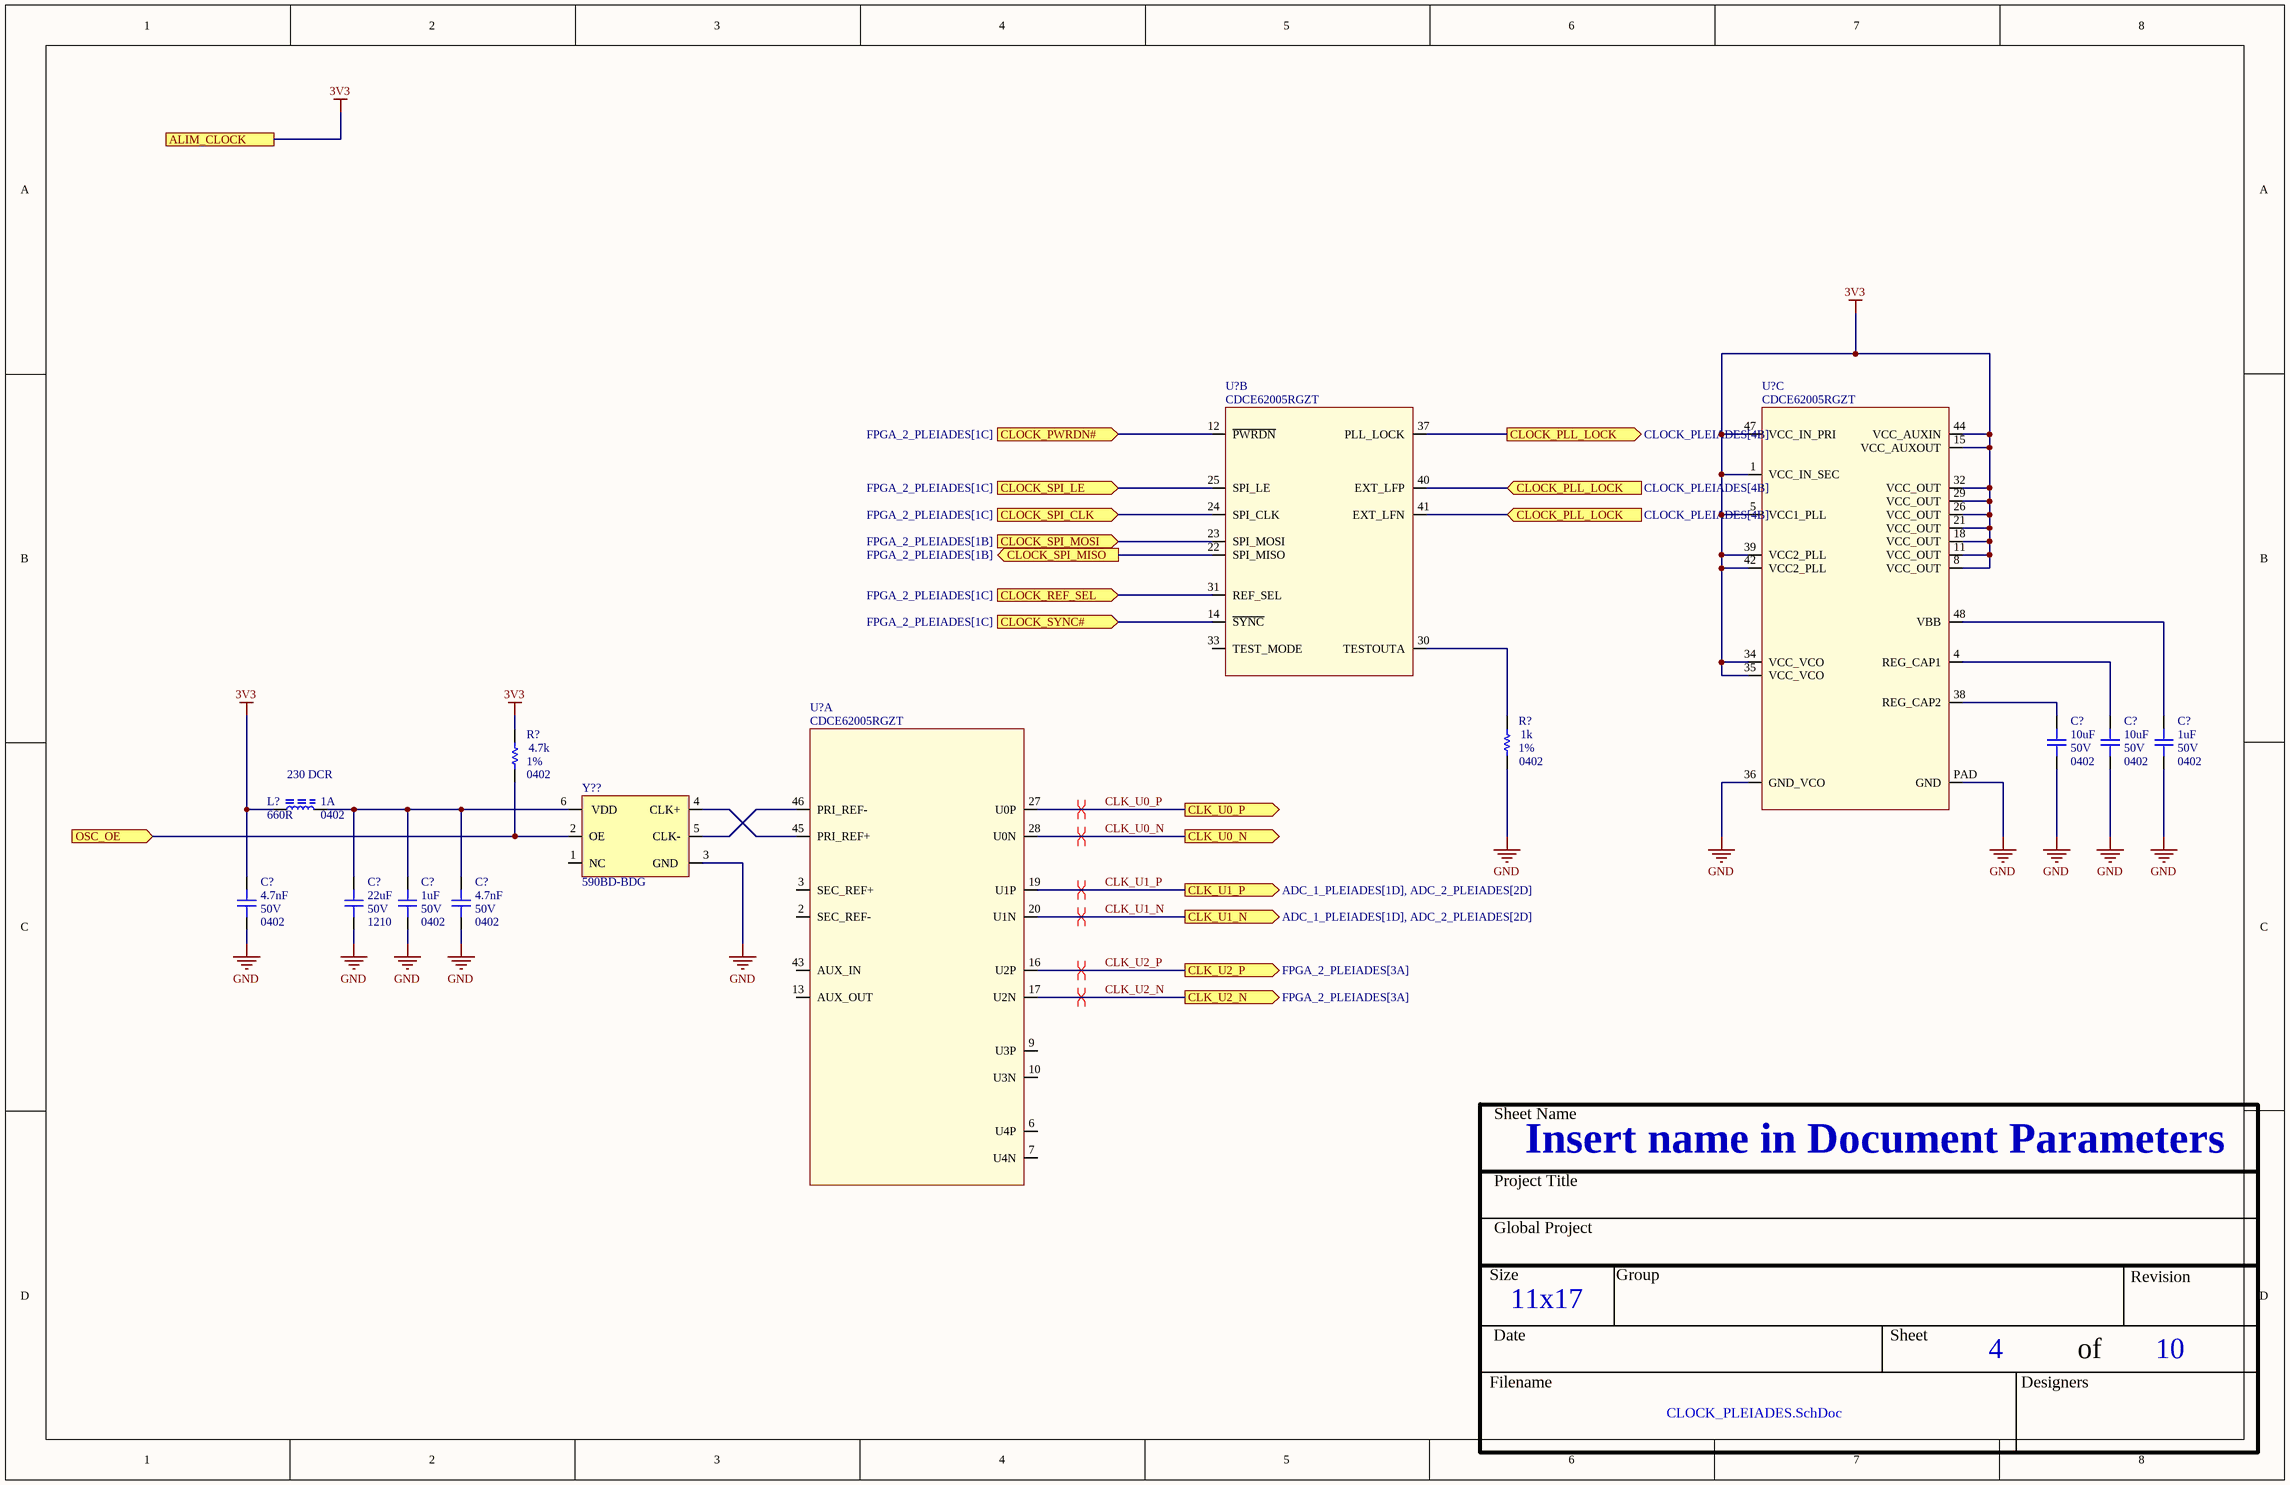
[diagram p3: CLOCK_PLEIADES.SchDoc]

### Parts
(Parts that share a designator on the sheet are numbered #1, #2 ... from top to bottom, then left to right.)
C?#1  value 10uF  Voltage: 50V  Package: 0402  [CAP_0402]  (hidden comment: CAP - 0402)
C?#2  value 10uF  Voltage: 50V  Package: 0402  [CAP_0402]  (hidden comment: CAP - 0402)
C?#3  value 1uF  Voltage: 50V  Package: 0402  [CAP_0402]  (hidden comment: CAP - 0402)
C?#4  value 4.7nF  Voltage: 50V  Package: 0402  [CAP_0402]  (hidden comment: CAP - 0402)
C?#5  value 22uF  Voltage: 50V  Package: 1210  [CAP_1210]  (hidden comment: CAP - 1210)
C?#6  value 1uF  Voltage: 50V  Package: 0402  [CAP_0402]  (hidden comment: CAP - 0402)
C?#7  value 4.7nF  Voltage: 50V  Package: 0402  [CAP_0402]  (hidden comment: CAP - 0402)
L?#1  value 660R  Current: 1A  Package: 0402  [FER_0402]  (hidden comment: FER - 0402)
R?#1  value 1k  Package: 0402  Precision: 1%  [RES_0402]  (hidden comment: RES - 0402)
R?#2  value 4.7k  Package: 0402  Precision: 1%  [RES_0402]  (hidden comment: RES - 0402)
U?#6  CDCE62005RGZT  [TIM_CDCE62005RGZT]  (part B of 3)
U?#7  CDCE62005RGZT  [TIM_CDCE62005RGZT]  (part C of 3)
U?#8  CDCE62005RGZT  [TIM_CDCE62005RGZT]  (part A of 3)
Y??#1  590BD-BDG  [OSC_590BD-BDG]

### Ports
ALIM_CLOCK, CLK_U0_N (out), CLK_U0_P (out), CLK_U1_N (out, see ADC_1_PLEIADES[1D], ADC_2_PLEIADES[2D]), CLK_U1_P (out, see ADC_1_PLEIADES[1D], ADC_2_PLEIADES[2D]), CLK_U2_N (out, see FPGA_2_PLEIADES[3A]), CLK_U2_P (out, see FPGA_2_PLEIADES[3A]), CLOCK_PLL_LOCK (in, see CLOCK_PLEIADES[4B]), CLOCK_PLL_LOCK (out, see CLOCK_PLEIADES[4B]), CLOCK_PWRDN# (in, see FPGA_2_PLEIADES[1C]), CLOCK_REF_SEL (in, see FPGA_2_PLEIADES[1C]), CLOCK_SPI_CLK (in, see FPGA_2_PLEIADES[1C]), CLOCK_SPI_LE (in, see FPGA_2_PLEIADES[1C]), CLOCK_SPI_MISO (out, see FPGA_2_PLEIADES[1B]), CLOCK_SPI_MOSI (in, see FPGA_2_PLEIADES[1B]), CLOCK_SYNC# (in, see FPGA_2_PLEIADES[1C]), OSC_OE (in)

### Nets
3V3: C?#1.1 C?#2.1 C?#3.1 C?#4.1 C?#4.2 C?#5.1 C?#6.1 C?#7.1 L?#1.2 R?#1.1 R?#2.2 U?#7.1(VCC_IN_SEC) U?#7.5(VCC1_PLL) U?#7.8(VCC_OUT) U?#7.11(VCC_OUT) U?#7.15(VCC_AUXOUT) U?#7.18(VCC_OUT) U?#7.21(VCC_OUT) U?#7.26(VCC_OUT) U?#7.29(VCC_OUT) U?#7.32(VCC_OUT) U?#7.34(VCC_VCO) U?#7.35(VCC_VCO) U?#7.36(GND_VCO) U?#7.39(VCC2_PLL) U?#7.42(VCC2_PLL) U?#7.44(VCC_AUXIN) U?#7.47(VCC_IN_PRI) U?#7.PAD(GND) Y??#1.3(GND) ; port ALIM_CLOCK  [also labelled GND]  [project net +0V75]
CLK_U0_N: U?#8.28(U0N) ; port CLK_U0_N
CLK_U0_P: U?#8.27(U0P) ; port CLK_U0_P
CLK_U1_N: U?#8.20(U1N) ; port CLK_U1_N
CLK_U1_P: U?#8.19(U1P) ; port CLK_U1_P
CLK_U2_N: U?#8.17(U2N) ; port CLK_U2_N
CLK_U2_P: U?#8.16(U2P) ; port CLK_U2_P
NetC?#1_2: C?#1.2 U?#7.38(REG_CAP2)
NetC?#2_2: C?#2.2 U?#7.4(REG_CAP1)
NetC?#3_2: C?#3.2 U?#7.48(VBB)
NetC?#5_2: C?#5.2 C?#6.2 C?#7.2 L?#1.1 Y??#1.6(VDD)
NetR?#1_2: R?#1.2 U?#6.30(TESTOUTA)
NetR?#2_1: R?#2.1 Y??#1.2(OE) ; port OSC_OE
NetU?#3_AC15: U?#6.23(SPI_MOSI) ; port CLOCK_SPI_MOSI
NetU?#3_AC16: U?#6.25(SPI_LE) ; port CLOCK_SPI_LE
NetU?#3_AD14: U?#6.24(SPI_CLK) ; port CLOCK_SPI_CLK
NetU?#3_AD15: U?#6.12(~{PWRDN}) ; port CLOCK_PWRDN#
NetU?#3_AD17: U?#6.31(REF_SEL) ; port CLOCK_REF_SEL
NetU?#3_AE17: U?#6.22(SPI_MISO) ; port CLOCK_SPI_MISO
NetU?#3_V15: U?#6.14(~{SYNC}) ; port CLOCK_SYNC#
NetU?#6_37: U?#6.37(PLL_LOCK) U?#6.40(EXT_LFP) U?#6.41(EXT_LFN) ; port CLOCK_PLL_LOCK
NetU?#8_45: U?#8.45(PRI_REF+) Y??#1.4(CLK+)
NetU?#8_46: U?#8.46(PRI_REF-) Y??#1.5(CLK-)

Not connected (* = marked no-connect by the designer): U?#6 33(TEST_MODE); U?#8 2(SEC_REF-) 3(SEC_REF+) 6(U4P) 7(U4N) 9(U3P) 10(U3N) 13(AUX_OUT) 43(AUX_IN); Y??#1 1(NC)

### Layout directives
differential pair: CLK_U0_N, CLK_U0_P, CLK_U1_N, CLK_U1_P, CLK_U2_N, CLK_U2_P

### Notes on the sheet
- (near L?#1) 230 DCR
- Sheet Name
- Project Title
- Global Project
- Size
- Group
- Revision
- Date
- Sheet
- of
- Filename
- Designers

### Library data of the parts
C?#1-C?#4 C?#6 C?#7 = CAP - 0402: Precision: 10%; Current: *; CreatedBy: Jonathan Bouchard; Power: *
C?#5 = CAP - 1210: Precision: 10%; Current: *; CreatedBy: Jonathan Bouchard; Power: *
R?#1 R?#2 = RES - 0402: Voltage: 50V; Power: 1/16W; Current: *; CreatedBy: Jonathan Bouchard
U?#6-U?#8 = TIM_CDCE62005RGZT: TIM - CLK SYNTH JITTER CLEANER 3:5 - QFN-48; Voltage: 3 V ~ 3.6 V; Mfg: Texas Instruments; Current: *; Power: *; Mfg Part Number: CDCE62005RGZT; HelpURL: http://www.ti.com/lit/ds/symlink/cdce62005.pdf; CreatedBy: Jonathan Bouchard; Temperature: -40°C ~ 85°C; Value: *; Precision: *; Package: QFN-48; Supplier 1: Digikey; Supplier Part Number 1: 296-23947-1-ND
Y??#1 = OSC_590BD-BDG: TIM - OSC PROG 125MHz ~ 214.999MHz LVDS 3.3V 7PPM EN/DS - 6-SMD; Manufacturer #1: Silicon Labs; Current Rating: 100 mA (supply); Note: Spécifié la fréquence lors de la commande; Voltage rating: 3.3V (supply); Polarized: Yes; Value: ±7ppm (freq Stability), ±20ppm (freq stability total); Magnetic Material: UNKNOWN; GRAMS Lib Spec: 2.8; Manufacturer #2: *; Power Max: *; Part Number #1: 590BD-BDG; Part Number #2: *; HelpURL: https://www.silabs.com/documents/public/data-sheets/Si590-591.pdf; Supplier 1: Digi-Key; Supplier Part Number 1: 590BD-BDG-ND; Assembly Type: SMD; Temperature: -40°C ~ 85°C; Package: 6-SMD; CreatedBy/Date: from 590BD-CDG; Tolerance: *; VerifiedBy: Caroline Paulin / 3/10/2019; Cryo: UNKNOWN
L?#1 = FER - 0402: Voltage: *; CreatedBy: Jonathan Bouchard; Power: *; Precision: *

## Sheet FLASH_PLEIADES.SchDoc
size Tabloid; SheetNumber: 5; SheetTotal: 5; Sheet_Name: Insert name in Document Parameters; Size: 11x17
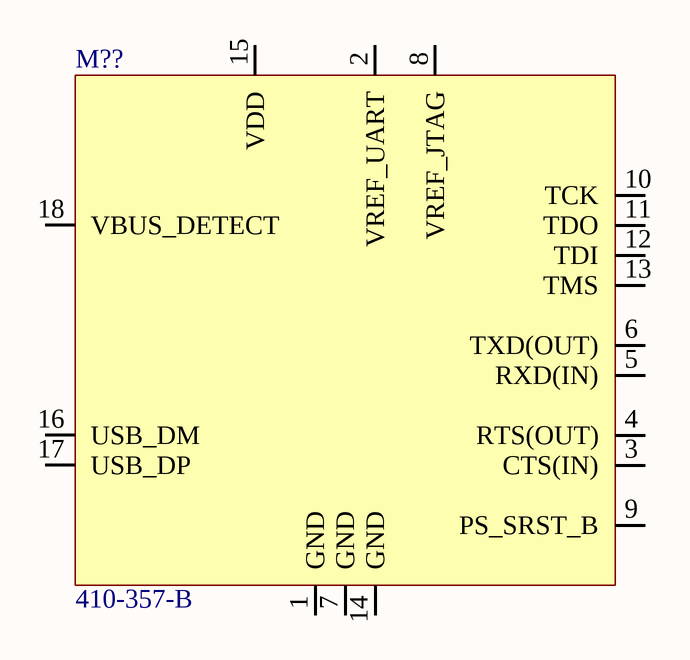
[diagram p4: FLASH_PLEIADES.SchDoc]

### Parts
(Parts that share a designator on the sheet are numbered #1, #2 ... from top to bottom, then left to right.)
M??#2  410-357-B  [MOD_JTAG_410-357-B]

### Nets

Not connected (* = marked no-connect by the designer): M??#2 1(GND) 2(VREF_UART) 3(CTS(IN)) 4(RTS(OUT)) 5(RXD(IN)) 6(TXD(OUT)) 7(GND) 8(VREF_JTAG) 9(PS_SRST_B) 10(TCK) 11(TDO) 12(TDI) 13(TMS) 14(GND) 15(VDD) 16(USB_DM) 17(USB_DP) 18(VBUS_DETECT)

### Notes on the sheet
- Sheet Name
- Project Title
- Global Project
- Size
- Group
- Revision
- Date
- Sheet
- of
- Filename
- Designers

### Library data of the parts
M??#2 = MOD_JTAG_410-357-B: as M??#1 on sheet USB_PLEIADES; Value: *; Tolerance: *; Current Rating: *; Power Max: *; HelpURL: https://reference.digilentinc.com/_media/reference/programmers/jtag-smt3/jtag-smt3-nc_rm.pdf; CreatedBy/Date: Tommy Rossignol 2018-11-23; VerifiedBy: Nicolas V. (2019-01-28); Temperature: -40°C ~ 85°C; Package: 18-pad SMT; Manufacturer #2: *; Assembly Type: SMD; Part Number #2: *; Part Number #1: 410-357-B; Supplier 1: Digi-Key; Supplier Part Number 1: 1286-1196-ND; Cryo: UNKNOWN

## Sheet ETHERNET_PLEIADES.SchDoc
size Tabloid; SheetNumber: 7; SheetTotal: 10; Sheet_Name: Insert name in Document Parameters; Size: 11x17
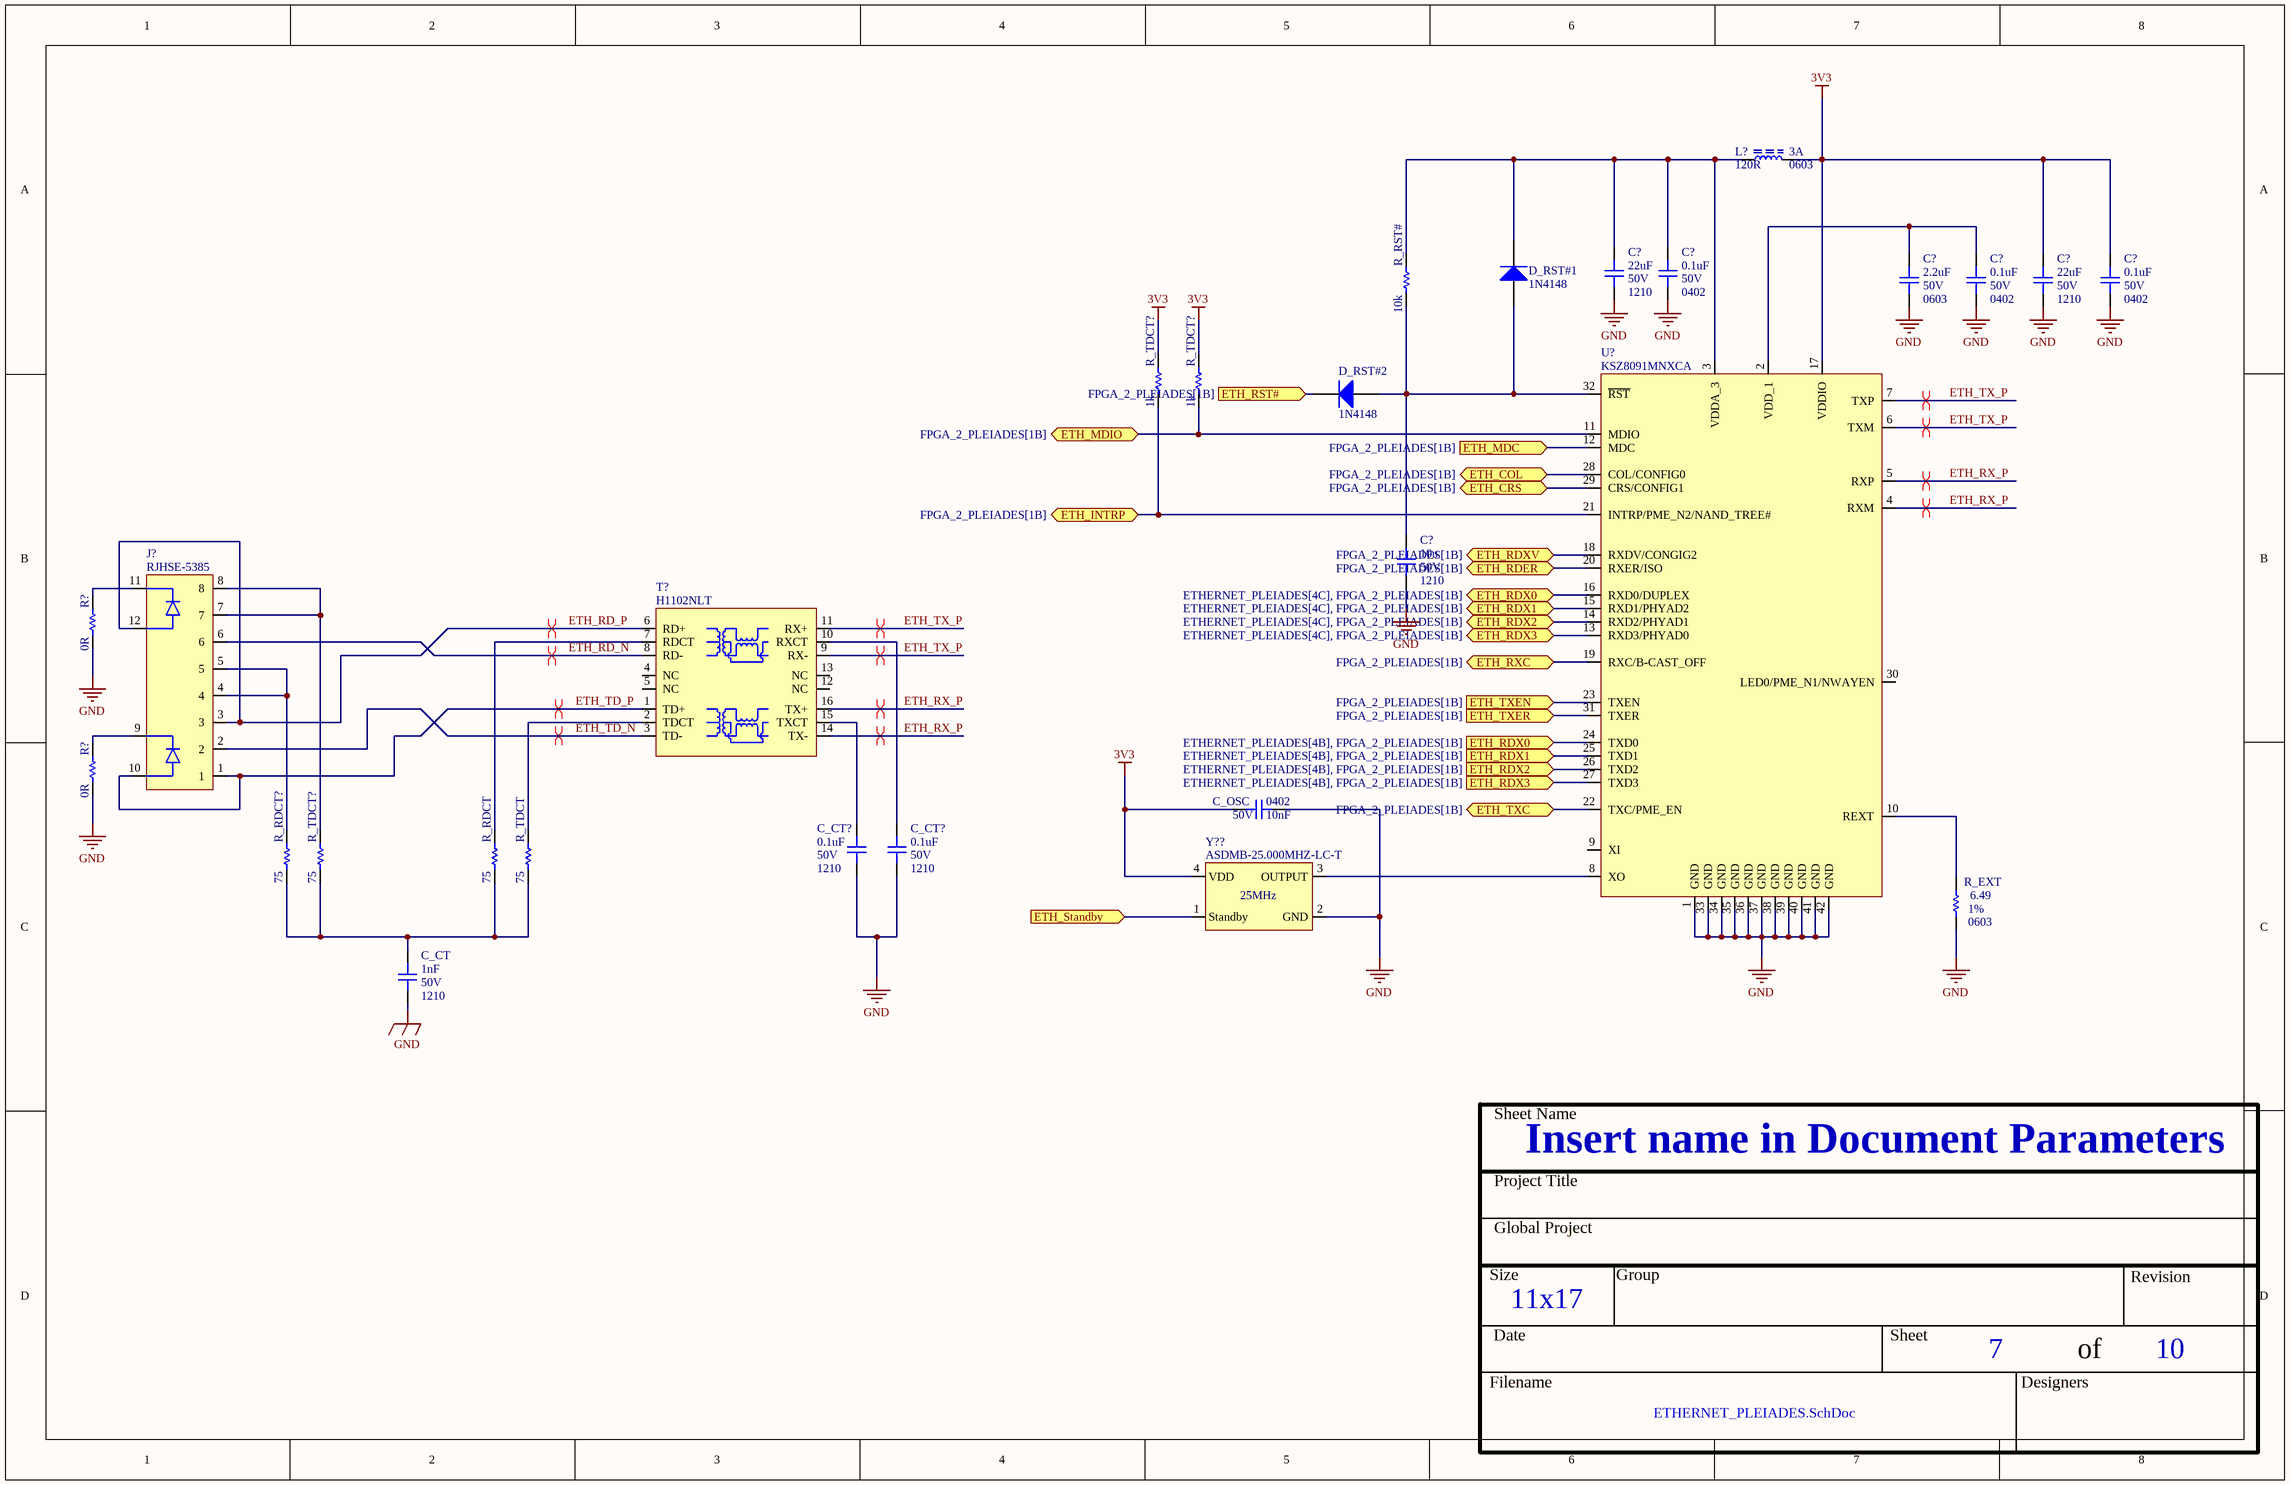
[diagram p5: ETHERNET_PLEIADES.SchDoc]

### Parts
(Parts that share a designator on the sheet are numbered #1, #2 ... from top to bottom, then left to right.)
C?#8  value 22uF  Voltage: 50V  Package: 1210  [CAP_1210]  (hidden comment: CAP - 1210)
C?#9  value 0.1uF  Voltage: 50V  Package: 0402  [CAP_0402]  (hidden comment: CAP - 0402)
C?#10  value 2.2uF  Voltage: 50V  Package: 0603  [CAP_0603]  (hidden comment: CAP - 0603)
C?#11  value 0.1uF  Voltage: 50V  Package: 0402  [CAP_0402]  (hidden comment: CAP - 0402)
C?#12  value 22uF  Voltage: 50V  Package: 1210  [CAP_1210]  (hidden comment: CAP - 1210)
C?#13  value 0.1uF  Voltage: 50V  Package: 0402  [CAP_0402]  (hidden comment: CAP - 0402)
C?#14  value 10u  Voltage: 50V  Package: 1210  [CAP_1210]  (hidden comment: CAP - 1210)
C_CT  value 1nF  Voltage: 50V  Package: 1210  [CAP_1210]  (hidden comment: CAP - 1210)
C_CT?#1  value 0.1uF  Voltage: 50V  Package: 1210  [CAP_1210]  (hidden comment: CAP - 1210)
C_CT?#2  value 0.1uF  Voltage: 50V  Package: 1210  [CAP_1210]  (hidden comment: CAP - 1210)
C_OSC  value 10nF  Voltage: 50V  Package: 0402  [CAP_0402]  (hidden comment: CAP - 0402)
D_RST#1  1N4148  [NXP-SOD27-2_V]
D_RST#2  1N4148  [NXP-SOD27-2_V]
J?#1  RJHSE-5385  [CONN_ETHERNET_RJHSE-5385]
L?#2  value 120R  Current: 3A  Package: 0603  [FER_0603]  (hidden comment: FER - 0603)
R?#3  value 0R  [RES_0402]  (hidden comment: RES - 0402)
R?#4  value 0R  [RES_0402]  (hidden comment: RES - 0402)
R_EXT  value 6.49  Package: 0603  Precision: 1%  [RES_0603]  (hidden comment: RES - 0603)
R_RDCT  value 75  [RES_0402]  (hidden comment: RES - 0402)
R_RDCT?  value 75  [RES_0402]  (hidden comment: RES - 0402)
R_RST#  value 10k  [RES_0402]  (hidden comment: RES - 0402)
R_TDCT  value 75  [RES_0402]  (hidden comment: RES - 0402)
R_TDCT?#1  value 1k  [RES_0402]  (hidden comment: RES - 0402)
R_TDCT?#2  value 1k  [RES_0402]  (hidden comment: RES - 0402)
R_TDCT?#3  value 75  [RES_0402]  (hidden comment: RES - 0402)
T?  H1102NLT  [TRANSFO_H1102NLT]
U?#9  KSZ8091MNXCA  [COM_ETH_PHY_KSZ8091MNXCA]
Y??#2  ASDMB-25.000MHZ-LC-T  [OSC_ASDMB-25.000MHZ-LC-T]

### Ports
ETH_COL (bidir, see FPGA_2_PLEIADES[1B]), ETH_CRS (bidir, see FPGA_2_PLEIADES[1B]), ETH_INTRP (bidir, see FPGA_2_PLEIADES[1B]), ETH_MDC (in, see FPGA_2_PLEIADES[1B]), ETH_MDIO (bidir, see FPGA_2_PLEIADES[1B]), ETH_RDER (bidir, see FPGA_2_PLEIADES[1B]), ETH_RDX0 (bidir, see ETHERNET_PLEIADES[4C], FPGA_2_PLEIADES[1B]), ETH_RDX0 (in, see ETHERNET_PLEIADES[4B], FPGA_2_PLEIADES[1B]), ETH_RDX1 (bidir, see ETHERNET_PLEIADES[4C], FPGA_2_PLEIADES[1B]), ETH_RDX1 (in, see ETHERNET_PLEIADES[4B], FPGA_2_PLEIADES[1B]), ETH_RDX2 (bidir, see ETHERNET_PLEIADES[4C], FPGA_2_PLEIADES[1B]), ETH_RDX2 (in, see ETHERNET_PLEIADES[4B], FPGA_2_PLEIADES[1B]), ETH_RDX3 (bidir, see ETHERNET_PLEIADES[4C], FPGA_2_PLEIADES[1B]), ETH_RDX3 (in, see ETHERNET_PLEIADES[4B], FPGA_2_PLEIADES[1B]), ETH_RDXV (bidir, see FPGA_2_PLEIADES[1B]), ETH_RST# (in, see FPGA_2_PLEIADES[1B]), ETH_RXC (bidir, see FPGA_2_PLEIADES[1B]), ETH_Standby (in), ETH_TXC (bidir, see FPGA_2_PLEIADES[1B]), ETH_TXEN (in, see FPGA_2_PLEIADES[1B]), ETH_TXER (in, see FPGA_2_PLEIADES[1B])

### Nets
3V3: C?#8.1 C?#9.1 C?#10.1 C?#11.1 C?#12.1 C?#12.2 C?#13.1 C?#13.2 C?#14.1 C_CT.1 C_CT?#1.1 C_CT?#2.1 C_OSC.1 C_OSC.2 L?#2.1 R?#3.1 R?#4.1 R_EXT.1 R_TDCT?#1.2 R_TDCT?#2.2 U?#9.1(GND) U?#9.17(VDDIO) U?#9.33(GND) U?#9.34(GND) U?#9.35(GND) U?#9.36(GND) U?#9.37(GND) U?#9.38(GND) U?#9.39(GND) U?#9.40(GND) U?#9.41(GND) U?#9.42(GND) Y??#2.2(GND) Y??#2.4(VDD)  [also labelled GND]  [project net +0V75]
ETH_RD_N: J?#1.6 T?.8(RD-)
ETH_RD_P: J?#1.3 J?#1.12(LED2_A) T?.6(RD+)
ETH_RX_P: T?.14(TX-) T?.16(TX+) U?#9.4(RXM) U?#9.5(RXP)
ETH_TD_N: J?#1.2 T?.3(TD-)
ETH_TD_P: J?#1.1 J?#1.10(LED1_A) T?.1(TD+)
ETH_TX_P: T?.9(RX-) T?.11(RX+) U?#9.6(TXM) U?#9.7(TXP)
NetC?#8_2: C?#8.2 C?#9.2 D_RST#1.2(K) L?#2.2 R_RST#.2 U?#9.3(VDDA_3)
NetC?#10_2: C?#10.2 C?#11.2 U?#9.2(VDD_1)
NetC?#14_2: C?#14.2 D_RST#1.1(A) D_RST#2.1(A) R_RST#.1 U?#9.32(~{RST})
NetC_CT?#1_2: C_CT?#1.2 T?.15(TXCT)
NetC_CT?#2_2: C_CT?#2.2 T?.10(RXCT)
NetC_CT_2: C_CT.2 R_RDCT.1 R_RDCT?.1 R_TDCT.1 R_TDCT?#3.1
NetD_RST#2_2: D_RST#2.2(K) ; port ETH_RST#
NetJ?#1_4: J?#1.4 J?#1.5 R_RDCT?.2
NetJ?#1_7: J?#1.7 J?#1.8 R_TDCT?#3.2
NetJ?#1_9: J?#1.9(LED1_K) R?#4.2
NetJ?#1_11: J?#1.11(LED2_K) R?#3.2
NetR_EXT_2: R_EXT.2 U?#9.10(REXT)
NetR_RDCT_2: R_RDCT.2 T?.7(RDCT)
NetR_TDCT?#1_1: R_TDCT?#1.1 U?#9.21(INTRP/PME_N2/NAND_TREE#) ; port ETH_INTRP
NetR_TDCT?#2_1: R_TDCT?#2.1 U?#9.11(MDIO) ; port ETH_MDIO
NetR_TDCT_2: R_TDCT.2 T?.2(TDCT)
NetU?#3_AA17: U?#9.23(TXEN) ; port ETH_TXEN
NetU?#3_AA18: U?#9.31(TXER) ; port ETH_TXER
NetU?#3_AA19: U?#9.16(RXD0/DUPLEX) U?#9.24(TXD0) ; port ETH_RDX0
NetU?#3_AC17: U?#9.15(RXD1/PHYAD2) U?#9.25(TXD1) ; port ETH_RDX1
NetU?#3_AC20: U?#9.18(RXDV/CONGIG2) ; port ETH_RDXV
NetU?#3_AD16: U?#9.14(RXD2/PHYAD1) U?#9.26(TXD2) ; port ETH_RDX2
NetU?#3_AD18: U?#9.19(RXC/B-CAST_OFF) ; port ETH_RXC
NetU?#3_AD21: U?#9.20(RXER/ISO) ; port ETH_RDER
NetU?#3_AE15: U?#9.29(CRS/CONFIG1) ; port ETH_CRS
NetU?#3_AF15: U?#9.22(TXC/PME_EN) ; port ETH_TXC
NetU?#3_AF16: U?#9.13(RXD3/PHYAD0) U?#9.27(TXD3) ; port ETH_RDX3
NetU?#3_AF18: U?#9.12(MDC) ; port ETH_MDC
NetU?#3_Y16: U?#9.28(COL/CONFIG0) ; port ETH_COL
NetU?#9_8: U?#9.8(XO) Y??#2.3(OUTPUT)
NetY??#2_1: Y??#2.1(Standby) ; port ETH_Standby

Not connected (* = marked no-connect by the designer): T? 4(NC) 5(NC) 12(NC) 13(NC); U?#9 9(XI) 30(LED0/PME_N1/NWAYEN)

### Layout directives
differential pair: ETH_RD_N, ETH_RD_P, ETH_RX_P, ETH_TD_N, ETH_TD_P, ETH_TX_P

### Notes on the sheet
- Sheet Name
- Project Title
- Global Project
- Size
- Group
- Revision
- Date
- Sheet
- of
- Filename
- Designers

### Library data of the parts
C?#8 C?#12 C?#14 C_CT C_CT?#1 C_CT?#2 = CAP - 1210: Precision: 10%; Current: *; CreatedBy: Jonathan Bouchard
  C?#8 C?#12 C?#14 C_CT C_CT?#2: Power: *
  C_CT?#1: Power: 0.1uF
C?#9 C?#11 C?#13 C_OSC = CAP - 0402: Precision: 10%; Current: *; CreatedBy: Jonathan Bouchard; Power: *
C?#10 = CAP - 0603: Precision: 10%; Current: *; CreatedBy: Jonathan Bouchard; Power: *
D_RST#1 D_RST#2 = CMP-004-00000-2: High Speed Diode, 100 V, 0.45 A, -65 to 175 degC, 2-Pin SOD27, RoHS, Bulk; Manufacturer: Fairchild; Elements: 1; Recovery Time: 4ns; Forward Current: 300mA; Power: 500mW; Forward Voltage: 1V; Max Surge Current: 4A; Peak Reverse Current: 5uA; Datasheet URL: http://www.nxp.com/documents/data_sheet/1N4148_1N4448.pdf; Min Operating Temperature: -65°C; Manufacturer URL: https://www.fairchildsemi.com/; Packaging: Bulk; Diameter: 1.91mm; Pins: 2; Package URL: http://www.nxp.com/documents/data_sheet/1N4148_1N4448.pdf; Package Reference: SOD27; Max Operating Temperature: 175°C; Package Quantity: 2000; Case/Package: DO; Datasheet Version: Aug-04; RoHS Compliant: True
J?#1 = CONN_ETHERNET_RJHSE-5385: CONN - MOD JACK RJ45 R/A ETHERNET - TH; Mfg: Amphenol; Voltage: *; Current: *; Power: *; Mfg Part Number: RJHSE-5385; HelpURL: https://www.amphenolcanada.com/ProductSearch/drawings/AC/RJHSE538X.pdf; CreatedBy: Jonathan Bouchard; Temperature: -55°C ~ 85°C; Value: *; Precision: *; Package: TH-12; Supplier 1: Digikey; Supplier Part Number 1: RJHSE-5385-ND
R?#3 R?#4 R_RDCT R_RDCT? R_RST# R_TDCT R_TDCT?#1-R_TDCT?#3 = RES - 0402: as R_FLASH_CCLK1 on sheet FPGA_2_PLEIADES; Current: *; CreatedBy: Jonathan Bouchard; Package: 0402
T? = TRANSFO_H1102NLT: TRANSFO - ETHERNET 10/100B-TX - SMD-16; Mfg: Pulse Eng.; Value: 1:1 (350uH); Voltage: *; Current: *; Power: *; Mfg Part Number: H1102NLT; HelpURL: http://media.digikey.com/pdf/Data%20Sheets/Pulse%20PDFs/10_100BASE-T%20Single%20Port%20SMD%20Magnetics_Rev2008.pdf; CreatedBy: Jonathan Bouchard; Temperature: -40°C to 85°C; Precision: *; Package: SMD-16; Supplier 1: Digikey; Supplier Part Number 1: 553-1532-1-ND
U?#9 = COM_ETH_PHY_KSZ8091MNXCA: COM - ETHERNET PHY 10/100 - QFN-32; Voltage: 1.8V, 2.5V, 3.3V; Mfg: Micrel; Current: *; Power: *; Mfg Part Number: KSZ8091MNXCA; HelpURL: http://ww1.microchip.com/downloads/en/DeviceDoc/00002275A.pdf; CreatedBy: Jonathan Bouchard; Temperature: 0°C ~ 70°C; Value: *; Precision: *; Package: QFN-32; Supplier 1: Digikey; Supplier Part Number 1: 576-4356-ND
Y??#2 = OSC_ASDMB-25.000MHZ-LC-T: OSC - 25MHz XO (Standard) LVCMOS - 4-SMD, No Lead; Manufacturer #1: Abracon LLC; Tolerance: ±50ppm; Voltage Rating: 1.8V ~ 3.3V; GRAMS Lib Spec: 2.8; Magnetic Material: Unknown; Polarized: Yes; Value: 25MHz; Current Rating: *; Power Max: *; HelpURL: https://abracon.com/Oscillators/ASDMB.pdf; CreatedBy/Date: Joël Lemay 2019-03-29; VerifiedBy: C. Paulin - 29 mai 2019; Temperature: -40°C ~ +85°C; Package: 4-SMD, No Lead; Manufacturer #2: *; Note: *; Assembly Type: SMD; Part Number #2: *; Part Number #1: ASDMB-25.000MHZ-LC-T; Supplier 1: Digi-Key; Supplier Part Number 1: 535-11730-1-ND; Cryo: UNKNOWN
L?#2 = FER - 0603: Voltage: *; CreatedBy: Jonathan Bouchard; Power: *; Precision: *
R_EXT = RES - 0603: Current: *; CreatedBy: Jonathan Bouchard

## Sheet DDR3_PLEIADES.SchDoc
size Tabloid; SheetNumber: 1; SheetTotal: 1; Sheet_Name: Insert name in Document Parameters; Size: 11x17
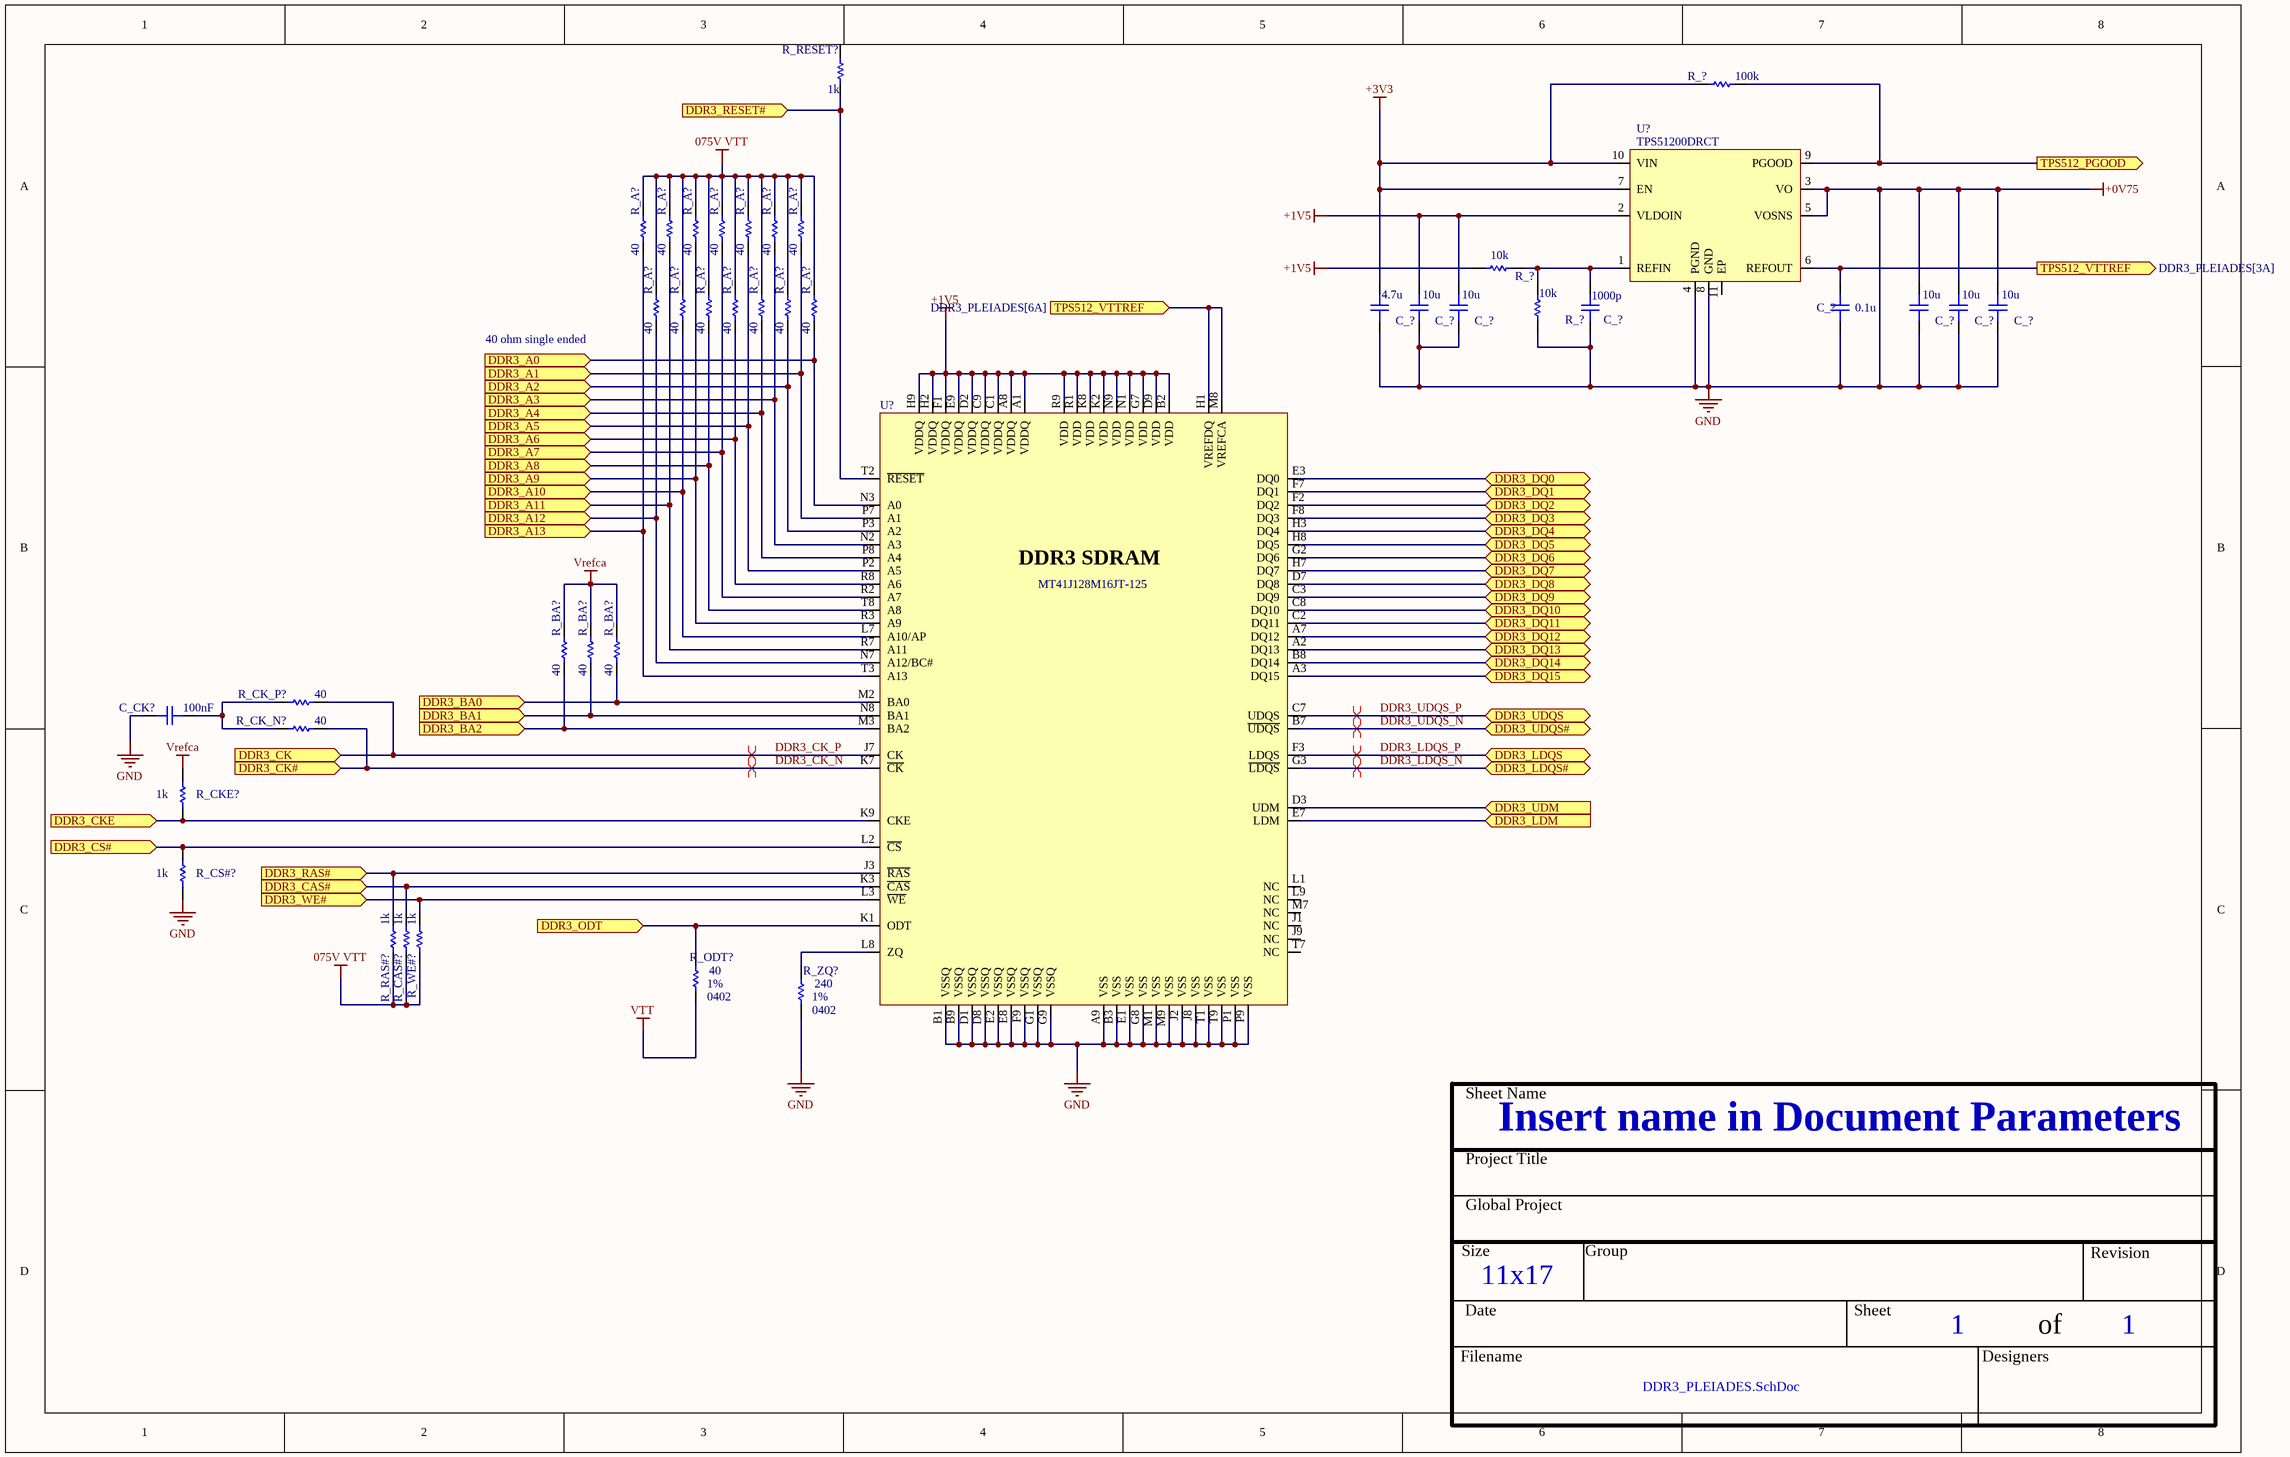
[diagram p6: DDR3_PLEIADES.SchDoc]

### Parts
(Parts that share a designator on the sheet are numbered #1, #2 ... from top to bottom, then left to right.)
C_?#1  value 4.7u  [CAP_0402]  (hidden comment: CAP - 0402)
C_?#2  value 10u  [CAP_0402]  (hidden comment: CAP - 0402)
C_?#3  value 10u  [CAP_0402]  (hidden comment: CAP - 0402)
C_?#4  value 1000p  [CAP_0402]  (hidden comment: CAP - 0402)
C_?#5  value 0.1u  [CAP_0402]  (hidden comment: CAP - 0402)
C_?#6  value 10u  [CAP_0402]  (hidden comment: CAP - 0402)
C_?#7  value 10u  [CAP_0402]  (hidden comment: CAP - 0402)
C_?#8  value 10u  [CAP_0402]  (hidden comment: CAP - 0402)
C_CK?  value 100nF  [CAP_0402]  (hidden comment: CAP - 0402)
R_?#1  value 100k  [RES_0402]  (hidden comment: RES - 0402)
R_?#2  value 10k  [RES_0402]  (hidden comment: RES - 0402)
R_?#3  value 10k  [RES_0402]  (hidden comment: RES - 0402)
R_A?#1  value 40  [RES_0402]  (hidden comment: RES - 0402)
R_A?#2  value 40  [RES_0402]  (hidden comment: RES - 0402)
R_A?#3  value 40  [RES_0402]  (hidden comment: RES - 0402)
R_A?#4  value 40  [RES_0402]  (hidden comment: RES - 0402)
R_A?#5  value 40  [RES_0402]  (hidden comment: RES - 0402)
R_A?#6  value 40  [RES_0402]  (hidden comment: RES - 0402)
R_A?#7  value 40  [RES_0402]  (hidden comment: RES - 0402)
R_A?#8  value 40  [RES_0402]  (hidden comment: RES - 0402)
R_A?#9  value 40  [RES_0402]  (hidden comment: RES - 0402)
R_A?#10  value 40  [RES_0402]  (hidden comment: RES - 0402)
R_A?#11  value 40  [RES_0402]  (hidden comment: RES - 0402)
R_A?#12  value 40  [RES_0402]  (hidden comment: RES - 0402)
R_A?#13  value 40  [RES_0402]  (hidden comment: RES - 0402)
R_A?#14  value 40  [RES_0402]  (hidden comment: RES - 0402)
R_BA?#1  value 40  [RES_0402]  (hidden comment: RES - 0402)
R_BA?#2  value 40  [RES_0402]  (hidden comment: RES - 0402)
R_BA?#3  value 40  [RES_0402]  (hidden comment: RES - 0402)
R_CAS#?  value 1k  [RES_0402]  (hidden comment: RES - 0402)
R_CK_N?  value 40  [RES_0402]  (hidden comment: RES - 0402)
R_CK_P?  value 40  [RES_0402]  (hidden comment: RES - 0402)
R_CKE?  value 1k  [RES_0402]  (hidden comment: RES - 0402)
R_CS#?  value 1k  [RES_0402]  (hidden comment: RES - 0402)
R_ODT?  value 40  Package: 0402  Precision: 1%  [RES_0402]  (hidden comment: RES - 0402)
R_RAS#?  value 1k  [RES_0402]  (hidden comment: RES - 0402)
R_RESET?  value 1k  [RES_0402]  (hidden comment: RES - 0402)
R_WE#?  value 1k  [RES_0402]  (hidden comment: RES - 0402)
R_ZQ?  value 240  Package: 0402  Precision: 1%  [RES_0402]  (hidden comment: RES - 0402)
U?#10  TPS51200DRCT  [REG_PMIC_TPS51200DRCT]
U?#11  MT41J128M16JT-125  [MEM_DDR3_MT41J128M16JT-125]

### Ports
DDR3_A0 (in), DDR3_A1 (in), DDR3_A2 (in), DDR3_A3 (in), DDR3_A4 (in), DDR3_A5 (in), DDR3_A6 (in), DDR3_A7 (in), DDR3_A8 (in), DDR3_A9 (in), DDR3_A10 (in), DDR3_A11 (in), DDR3_A12 (in), DDR3_A13 (in), DDR3_BA0 (in), DDR3_BA1 (in), DDR3_BA2 (in), DDR3_CAS# (in), DDR3_CK (in), DDR3_CK# (in), DDR3_CKE (in), DDR3_CS# (in), DDR3_DQ0 (bidir), DDR3_DQ1 (bidir), DDR3_DQ2 (bidir), DDR3_DQ3 (bidir), DDR3_DQ4 (bidir), DDR3_DQ5 (bidir), DDR3_DQ6 (bidir), DDR3_DQ7 (bidir), DDR3_DQ8 (bidir), DDR3_DQ9 (bidir), DDR3_DQ10 (bidir), DDR3_DQ11 (bidir), DDR3_DQ12 (bidir), DDR3_DQ13 (bidir), DDR3_DQ14 (bidir), DDR3_DQ15 (bidir), DDR3_LDM (in), DDR3_LDQS (bidir), DDR3_LDQS# (bidir), DDR3_ODT (in), DDR3_RAS# (in), DDR3_RESET# (in), DDR3_UDM (in), DDR3_UDQS (bidir), DDR3_UDQS# (bidir), DDR3_WE# (in), TPS512_PGOOD (out), TPS512_VTTREF (in, see DDR3_PLEIADES[6A]), TPS512_VTTREF (out, see DDR3_PLEIADES[3A])

### Nets
075V VTT: R_A?#1.2 R_A?#2.2 R_A?#3.2 R_A?#4.2 R_A?#5.2 R_A?#6.2 R_A?#7.2 R_A?#8.2 R_A?#9.2 R_A?#10.2 R_A?#11.2 R_A?#12.2 R_A?#13.2 R_A?#14.2 R_CAS#?.2 R_RAS#?.2 R_WE#?.2
+0V75: C_?#1.2 C_?#2.2 C_?#3.2 C_?#4.2 C_?#5.2 C_?#6.1 C_?#6.2 C_?#7.1 C_?#7.2 C_?#8.1 C_?#8.2 C_CK?.2 R_?#3.1 R_CS#?.1 R_ZQ?.1 U?#10.3(VO) U?#10.4(PGND) U?#10.5(VOSNS) U?#10.8(GND) U?#11.A9(VSS) U?#11.B1(VSSQ) U?#11.B3(VSS) U?#11.B9(VSSQ) U?#11.D1(VSSQ) U?#11.D8(VSSQ) U?#11.E1(VSS) U?#11.E2(VSSQ) U?#11.E8(VSSQ) U?#11.F9(VSSQ) U?#11.G1(VSSQ) U?#11.G8(VSS) U?#11.G9(VSSQ) U?#11.J2(VSS) U?#11.J8(VSS) U?#11.M1(VSS) U?#11.M9(VSS) U?#11.P1(VSS) U?#11.P9(VSS) U?#11.T1(VSS) U?#11.T9(VSS)  [also labelled GND]
+1V5: C_?#2.1 C_?#3.1 R_?#2.1 U?#10.2(VLDOIN) U?#11.A1(VDDQ) U?#11.A8(VDDQ) U?#11.B2(VDD) U?#11.C1(VDDQ) U?#11.C9(VDDQ) U?#11.D2(VDDQ) U?#11.D9(VDD) U?#11.E9(VDDQ) U?#11.F1(VDDQ) U?#11.G7(VDD) U?#11.H2(VDDQ) U?#11.H9(VDDQ) U?#11.K2(VDD) U?#11.K8(VDD) U?#11.N1(VDD) U?#11.N9(VDD) U?#11.R1(VDD) U?#11.R9(VDD)
+3V3: C_?#1.1 R_?#1.1 U?#10.7(EN) U?#10.10(VIN)
Vrefca: R_BA?#1.2 R_BA?#2.2 R_BA?#3.2 R_CKE?.1
VTT: R_ODT?.1
DDR3_CK_N: R_CK_N?.2 U?#11.K7(~{CK}) ; port DDR3_CK#
DDR3_CK_P: R_CK_P?.2 U?#11.J7(CK) ; port DDR3_CK
DDR3_LDQS_N: U?#11.G3(~{LDQS}) ; port DDR3_LDQS#
DDR3_LDQS_P: U?#11.F3(LDQS) ; port DDR3_LDQS
DDR3_UDQS_N: U?#11.B7(~{UDQS}) ; port DDR3_UDQS#
DDR3_UDQS_P: U?#11.C7(UDQS) ; port DDR3_UDQS
NetC_?#4_1: C_?#4.1 R_?#2.2 R_?#3.2 U?#10.1(REFIN)
NetC_?#5_1: C_?#5.1 U?#10.6(REFOUT) U?#11.H1(VREFDQ) U?#11.M8(VREFCA) ; port TPS512_VTTREF
NetC_CK?_1: C_CK?.1 R_CK_N?.1 R_CK_P?.1
NetR_?#1_2: R_?#1.2 U?#10.9(PGOOD) ; port TPS512_PGOOD
NetR_A?#1_1: R_A?#1.1 U?#11.T3(A13) ; port DDR3_A13
NetR_A?#2_1: R_A?#2.1 U?#11.R7(A11) ; port DDR3_A11
NetR_A?#3_1: R_A?#3.1 U?#11.R3(A9) ; port DDR3_A9
NetR_A?#4_1: R_A?#4.1 U?#11.R2(A7) ; port DDR3_A7
NetR_A?#5_1: R_A?#5.1 U?#11.P2(A5) ; port DDR3_A5
NetR_A?#6_1: R_A?#6.1 U?#11.N2(A3) ; port DDR3_A3
NetR_A?#7_1: R_A?#7.1 U?#11.P7(A1) ; port DDR3_A1
NetR_A?#8_1: R_A?#8.1 U?#11.N7(A12/BC#) ; port DDR3_A12
NetR_A?#9_1: R_A?#9.1 U?#11.L7(A10/AP) ; port DDR3_A10
NetR_A?#10_1: R_A?#10.1 U?#11.T8(A8) ; port DDR3_A8
NetR_A?#11_1: R_A?#11.1 U?#11.R8(A6) ; port DDR3_A6
NetR_A?#12_1: R_A?#12.1 U?#11.P8(A4) ; port DDR3_A4
NetR_A?#13_1: R_A?#13.1 U?#11.P3(A2) ; port DDR3_A2
NetR_A?#14_1: R_A?#14.1 U?#11.N3(A0) ; port DDR3_A0
NetR_BA?#1_1: R_BA?#1.1 U?#11.M3(BA2) ; port DDR3_BA2
NetR_BA?#2_1: R_BA?#2.1 U?#11.N8(BA1) ; port DDR3_BA1
NetR_BA?#3_1: R_BA?#3.1 U?#11.M2(BA0) ; port DDR3_BA0
NetR_CAS#?_1: R_CAS#?.1 U?#11.K3(~{CAS}) ; port DDR3_CAS#
NetR_CKE?_2: R_CKE?.2 U?#11.K9(CKE) ; port DDR3_CKE
NetR_CS#?_2: R_CS#?.2 U?#11.L2(~{CS}) ; port DDR3_CS#
NetR_ODT?_2: R_ODT?.2 U?#11.K1(ODT) ; port DDR3_ODT
NetR_RAS#?_1: R_RAS#?.1 U?#11.J3(~{RAS}) ; port DDR3_RAS#
NetR_RESET?_1: R_RESET?.1 U?#11.T2(~{RESET}) ; port DDR3_RESET#
NetR_WE#?_1: R_WE#?.1 U?#11.L3(~{WE}) ; port DDR3_WE#
NetR_ZQ?_2: R_ZQ?.2 U?#11.L8(ZQ)
NetU?#4_AA1: U?#11.C3(DQ9) ; port DDR3_DQ9
NetU?#4_AA2: U?#11.D7(DQ8) ; port DDR3_DQ8
NetU?#4_AB1: U?#11.A3(DQ15) ; port DDR3_DQ15
NetU?#4_AB3: U?#11.B8(DQ14) ; port DDR3_DQ14
NetU?#4_AD1: U?#11.A2(DQ13) ; port DDR3_DQ13
NetU?#4_AD3: U?#11.A7(DQ12) ; port DDR3_DQ12
NetU?#4_AE1: U?#11.C2(DQ11) ; port DDR3_DQ11
NetU?#4_AE2: U?#11.C8(DQ10) ; port DDR3_DQ10
NetU?#4_T1: U?#11.H8(DQ5) ; port DDR3_DQ5
NetU?#4_T3: U?#11.H3(DQ4) ; port DDR3_DQ4
NetU?#4_U1: U?#11.H7(DQ7) ; port DDR3_DQ7
NetU?#4_U2: U?#11.G2(DQ6) ; port DDR3_DQ6
NetU?#4_V4: U?#11.D3(UDM) ; port DDR3_UDM
NetU?#4_W1: U?#11.F8(DQ3) ; port DDR3_DQ3
NetU?#4_W2: U?#11.F2(DQ2) ; port DDR3_DQ2
NetU?#4_W3: U?#11.E7(LDM) ; port DDR3_LDM
NetU?#4_Y1: U?#11.F7(DQ1) ; port DDR3_DQ1
NetU?#4_Y3: U?#11.E3(DQ0) ; port DDR3_DQ0

Not connected (* = marked no-connect by the designer): R_RESET? 2; U?#10 11(EP); U?#11 J1(NC) J9(NC) L1(NC) L9(NC) M7(NC) T7(NC)

### Layout directives
differential pair: DDR3_CK_N, DDR3_CK_P, DDR3_LDQS_N, DDR3_LDQS_P, DDR3_UDQS_N, DDR3_UDQS_P

### Notes on the sheet
- 40 ohm single ended
- Sheet Name
- Project Title
- Global Project
- Size
- Group
- Revision
- Date
- Sheet
- of
- Filename
- Designers
- (in symbol MEM_DDR3_MT41J128M16JT-125:K TR) DDR3 SDRAM

### Library data of the parts
C_?#1-C_?#8 C_CK? = CAP - 0402: Precision: 10%; Voltage: 50V; Current: *; CreatedBy: Jonathan Bouchard; Power: *; Package: 0402
R_?#1-R_?#3 R_A?#1-R_A?#14 R_BA?#1-R_BA?#3 R_CAS#? R_CK_N? R_CK_P? R_CKE? R_CS#? R_RAS#? R_RESET? R_WE#? = RES - 0402: as R_FLASH_CCLK1 on sheet FPGA_2_PLEIADES; Current: *; CreatedBy: Jonathan Bouchard; Package: 0402
R_ODT? R_ZQ? = RES - 0402: Voltage: 50V; Power: 1/16W; Current: *; CreatedBy: Jonathan Bouchard
U?#10 = REG_PMIC_TPS51200DRCT: REG - DDR TERMINATION/REF REG - 10-VFDFN; Manufacturer #1: Texas Instruments; Value: DDR, DDR2, DDR3(L), DDR4; Voltage Rating: 2.375V ~ 3.5V; Current Rating: Source: 3A~4.5A, Sink: 3.5A~5.5A; GRAMS Lib Spec: 2.8; Magnetic Material: Unknown; Polarized: Yes; Tolerance: *; Power Max: *; HelpURL: http://www.ti.com/lit/ds/symlink/tps51200.pdf; CreatedBy/Date: Joel Lemay 2019-03-19; VerifiedBy: Nicolas V. (2019-05-31); Temperature: -40°C ~ 85°C; Package: 10-VFDFN; Manufacturer #2: *; Note: *; Assembly Type: SMD; Part Number #2: *; Part Number #1: TPS51200DRCT; Supplier 1: Digi-Key; Supplier Part Number 1: 296-23830-1-ND; Cryo: UNKNOWN
U?#11 = MEM_DDR3_MT41J128M16JT-125:K TR: MEM - DDR3 SDRAM 2GBIT 800MHZ - TFBGA-96; Voltage: 1.425 V ~ 1.575 V; Mfg: Micrel; Current: *; Power: *; Mfg Part Number: MT41J128M16JT-125; HelpURL: http://www.micron.com/~/media/Documents/Products/Data%20Sheet/DRAM/DDR3/2Gb_DDR3_SDRAM.pdf; CreatedBy: Jonathan Bouchard; Temperature: 0°C ~ 95°C (TC); Value: *; Precision: *; Package: TFBGA-96; Supplier 1: Digikey; Supplier Part Number 1: 557-1611-1-ND